# EAGLE design Seymour (EAGLE 9.1.3)

## Sheet 1 of 3
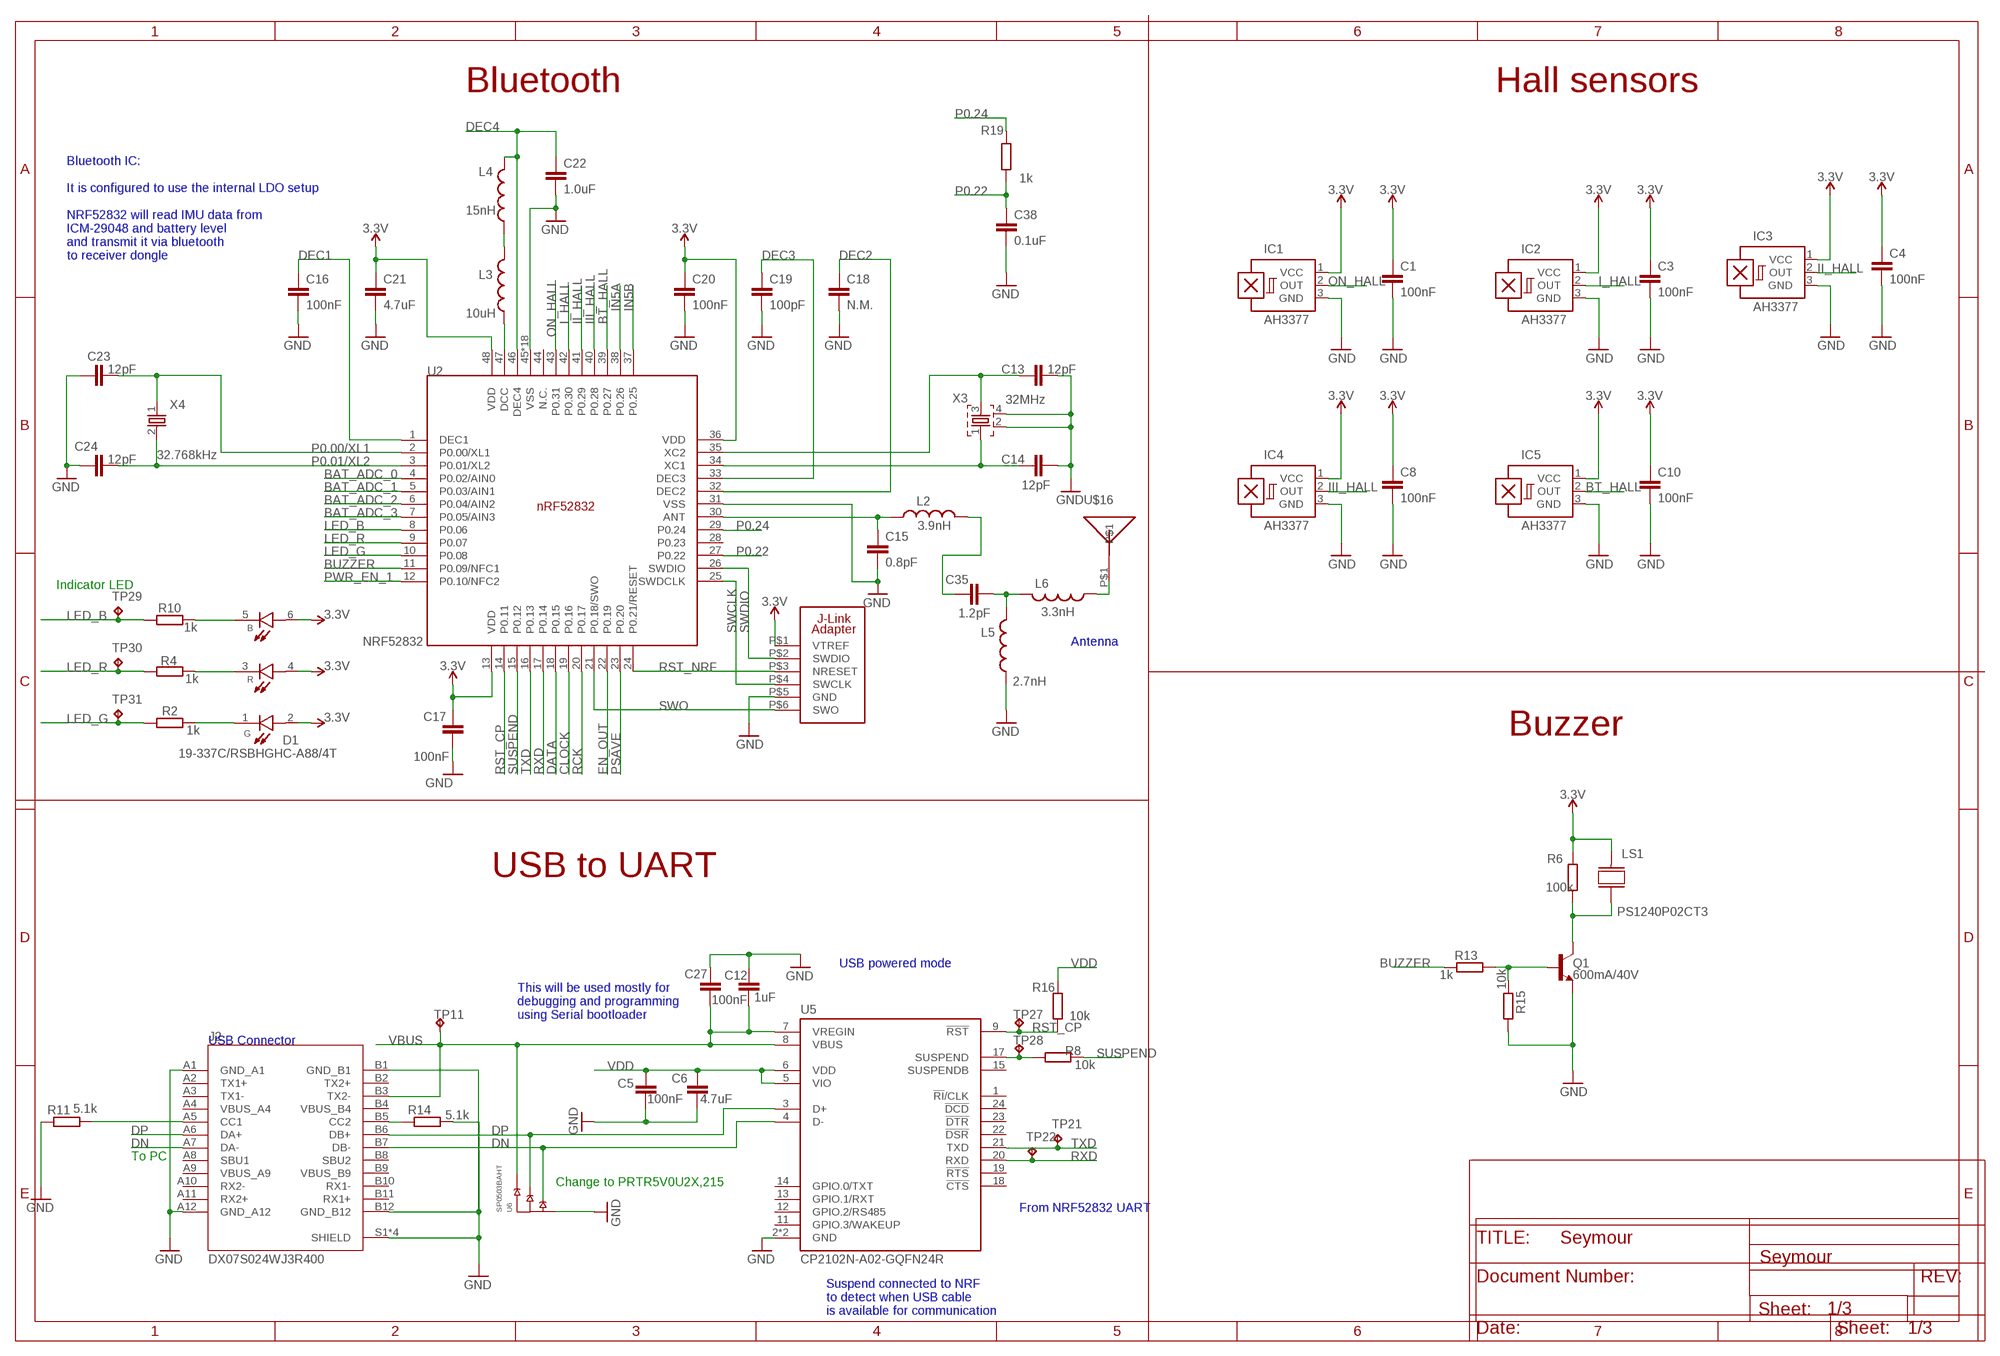
[diagram p0: schematic, sheet 1]

### Parts
C1  100nF  C-EUC0402  [C0402]
C3  100nF  C-EUC0402  [C0402]
C4  100nF  C-EUC0402  [C0402]
C5  100nF  C-EUC0402  [C0402]
C6  4.7uF  C-EUC0603  [C0603]
C8  100nF  C-EUC0402  [C0402]
C10  100nF  C-EUC0402  [C0402]
C12  1uF  C-EUC0603  [C0603]
C13  12pF  C-EUC0402  [C0402]
C14  12pF  C-EUC0402  [C0402]
C15  0.8pF  C-EUC0402  [C0402]
C16  100nF  C-EUC0603  [C0603]
C17  100nF  C-EUC0402  [C0402]
C18  N.M.  C-EUC0603  [C0603]
C19  100pF  C-EUC0402  [C0402]
C20  100nF  C-EUC0402  [C0402]
C21  4.7uF  C-EUC0603  [C0603]
C22  1.0uF  C-EUC0603  [C0603]
C23  12pF  C-EUC0402  [C0402]
C24  12pF  C-EUC0402  [C0402]
C27  100nF  C-EUC0402  [C0402]
C35  1.2pF  CAPACITOR_0402_N  [RESC0402_N]
C38  0.1uF  C-EUC0402  [C0402]
D1  19-337C/RSBHGHC-A88/4T  [LED_19-337C/RSBHGHC-A88/4T]
IC1  AH3377  A1203LH  [SOT23-W]
IC2  AH3377  A1203LH  [SOT23-W]
IC3  AH3377  A1203LH  [SOT23-W]
IC4  AH3377  A1203LH  [SOT23-W]
IC5  AH3377  A1203LH  [SOT23-W]
J2  DX07S024WJ3R400  [JAE_DX07S024WJ3R400]
L2  3.9nH  INDUCTOR_0402_N  [RESC0402_N]
L3  10uH  INDUCTOR_0603_N  [RESC0603_N]
L4  15nH  INDUCTOR_0402_N  [RESC0402_N]
L5  2.7nH  INDUCTOR_0402_N  [RESC0402_N]
L6  3.3nH  INDUCTOR_0402_N  [RESC0402_N]
LS1  PS1240P02CT3  [XDCR_PS1240P02CT3]
Q1  600mA/40V  TRANS_NPN-MMBT2222AL  [SOT23-3]
R2  1k  R-EU_R0402  [R0402]
R4  1k  R-EU_R0402  [R0402]
R6  100k  R-EU_R0402  [R0402]
R8  10k  R-EU_R0402  [R0402]
R10  1k  R-EU_R0402  [R0402]
R11  5.1k  R-EU_R0402  [R0402]
R13  1k  R-EU_R0402  [R0402]
R14  5.1k  R-EU_R0402  [R0402]
R15  10k  R-EU_R0402  [R0402]
R16  10k  R-EU_R0402  [R0402]
R19  1k  R-EU_R0402  [R0402]
TP11  TPTP06R  [TP06R]
TP21  TPTP06R  [TP06R]
TP22  TPTP06R  [TP06R]
TP27  TPTP06R  [TP06R]
TP28  TPTP06R  [TP06R]
TP29  TPTP06R  [TP06R]
TP30  TPTP06R  [TP06R]
TP31  TPTP06R  [TP06R]
U2  NRF52832  [QFN40P600X600X90-48_N]
U5  CP2102N-A02-GQFN24R  [QFN50P400X400X80-25N]
U6  SP0503BAHT  [SOT143]
U$1  J-LINK_6-PIN_ADAPTER-1  [J-LINK_6-PIN_ADAPTER_S]
U$16  ANT_2450AT18B100E  [2450AT18B100E]
X3  32MHz  XTAL_32MHZ  [BT-XTAL_2016_N]
X4  32.768kHz  XTAL_32KHZ  [XTAL_3215_N]

### Nets
3.3V: C1.1 C3.1 C4.1 C8.1 C10.1 C17.1 C20.1 C21.1 D1.2(G_A) D1.4(R_A) D1.6(B_A) IC1.1(VCC) IC2.1(VCC) IC3.1(VCC) IC4.1(VCC) IC5.1(VCC) LS1.2 R6.1 U2.13(VDD) U2.36(VDD) U2.48(VDD) U$1.P$1(VTREF) ; also sheet 2
ANT1: C15.1 L2.1 U2.30(ANT)
BAT_ADC_0: U2.4(P0.02/AIN0) ; also sheet 3
BAT_ADC_1: U2.5(P0.03/AIN1) ; also sheet 3
BAT_ADC_2: U2.6(P0.04/AIN2) ; also sheet 3
BAT_ADC_3: U2.7(P0.05/AIN3) ; also sheet 3
BT_HALL: IC5.2(OUT) U2.39(P0.27)
BUZZER: R13.1 U2.11(P0.09/NFC1)
CLOCK: U2.19(P0.16) ; also sheet 2
DATA: U2.18(P0.15) ; also sheet 2
DEC1: C16.1 U2.1(DEC1)
DEC2: C18.1 U2.32(DEC2)
DEC3: C19.1 U2.33(DEC3)
DEC4: C22.1 L4.2 U2.46(DEC4)
DN: J2.A7(DA-) J2.B7(DB-) U5.4(D-) U6.2(A)
DP: J2.A6(DA+) J2.B6(DB+) U5.3(D+) U6.3(B)
EN_OUT: U2.22(P0.19) ; also sheet 2
GND: C1.2 C3.2 C4.2 C5.1 C6.2 C8.2 C10.2 C12.1 C13.2 C14.2 C15.2 C16.2 C17.2 C18.2 C19.2 C20.2 C21.2 C22.2 C23.1 C24.1 C27.2 C38.2 IC1.3(GND) IC2.3(GND) IC3.3(GND) IC4.3(GND) IC5.3(GND) J2.A1(GND_A1) J2.A12(GND_A12) J2.B1(GND_B1) J2.B12(GND_B12) J2.S1(SHIELD) J2.S2(SHIELD) J2.S3(SHIELD) J2.S4(SHIELD) L5.1 Q1.2(E) R11.1 R14.2 R15.2 U2.31(VSS) U2.45(VSS) U2.PAD(VSS) U2.PAD@VIA01(VSS) U2.PAD@VIA02(VSS) U2.PAD@VIA03(VSS) U2.PAD@VIA04(VSS) U2.PAD@VIA05(VSS) U2.PAD@VIA06(VSS) U2.PAD@VIA07(VSS) U2.PAD@VIA08(VSS) U2.PAD@VIA09(VSS) U2.PAD@VIA10(VSS) U2.PAD@VIA11(VSS) U2.PAD@VIA12(VSS) U2.PAD@VIA13(VSS) U2.PAD@VIA14(VSS) U2.PAD@VIA15(VSS) U2.PAD@VIA16(VSS) U5.2(GND) U5.25(GND) U6.1(GND) U$1.P$5(GND) X3.2 X3.4 ; also sheet 2,3
I_HALL: IC2.2(OUT) U2.42(P0.30)
II_HALL: IC3.2(OUT) U2.41(P0.29)
III_HALL: IC4.2(OUT) U2.40(P0.28)
IN5A: U2.38(P0.26) ; also sheet 2
IN5B: U2.37(P0.25) ; also sheet 2
LED_B: R10.2 TP29.TP U2.8(P0.06)
LED_G: R2.2 TP31.TP U2.10(P0.08)
LED_R: R4.2 TP30.TP U2.9(P0.07) ; also sheet 3
N$1: C13.1 U2.35(XC2) X3.3
N$2: C35.2 L2.2
N$3: R8.1 TP28.TP U5.17(SUSPEND)
N$4: J2.A5(CC1) R11.2
N$5: J2.B5(CC2) R14.1
N$8: D1.3(R_C) R4.1
N$10: D1.5(B_C) R10.1
N$14: Q1.1(B) R13.2 R15.1
N$15: D1.1(G_C) R2.1
N$16: LS1.1 Q1.3(C) R6.2
N$17: L3.1 U2.47(DCC)
N$20: L3.2 L4.1
N$29: C35.1 L5.2 L6.2
N$30: L6.1 U$16.P$1
ON_HALL: IC1.2(OUT) U2.43(P0.31)
P0.00/XL1: C23.2 U2.2(P0.00/XL1) X4.1
P0.01/XL2: C24.2 U2.3(P0.01/XL2) X4.2
P0.22: C38.1 R19.1 U2.27(P0.22)
P0.24: R19.2 U2.29(P0.24)
PSAVE: U2.23(P0.20) ; also sheet 2
PWR_EN_1: U2.12(P0.10/NFC2) ; also sheet 2
RCK: U2.20(P0.17) ; also sheet 2
RST_CP: R16.2 TP27.TP U2.14(P0.11) U5.9(!RST)
RST_NRF: U2.24(P0.21/RESET) U$1.P$3(NRESET)
RXD: TP22.TP U2.17(P0.14) U5.20(RXD)
SUSPEND: R8.2 U2.15(P0.12)
SWCLK: U2.25(SWDCLK) U$1.P$4(SWCLK)
SWDIO: U2.26(SWDIO) U$1.P$2(SWDIO)
SWO: U2.21(P0.18/SWO) U$1.P$6(SWO)
TXD: TP21.TP U2.16(P0.13) U5.21(TXD)
VBUS: C12.2 C27.1 J2.B3(TX2-) TP11.TP U5.7(VREGIN) U5.8(VBUS) U6.4(C) ; also sheet 3
VDD: C5.2 C6.1 R16.1 U5.5(VIO) U5.6(VDD)
X2: C14.1 U2.34(XC1) X3.1
Unconnected: J2.A2(TX1+) J2.A3(TX1-) J2.A4(VBUS_A4) J2.A8(SBU1) J2.A9(VBUS_A9) J2.A10(RX2-) J2.A11(RX2+) J2.B2(TX2+) J2.B4(VBUS_B4) J2.B8(SBU2) J2.B9(VBUS_B9) J2.B10(RX1-) J2.B11(RX1+) U2.28(P0.23) U2.44(N.C.) U5.1(!RI!/CLK) U5.11(GPIO.3/WAKEUP) U5.12(GPIO.2/RS485) U5.13(GPIO.1/RXT) U5.14(GPIO.0/TXT) U5.15(SUSPENDB) U5.18(!CTS) U5.19(!RTS) U5.22(!DSR) U5.23(!DTR) U5.24(!DCD)

### Notes on the sheet
- Bluetooth | Hall sensors
- 1k
- Bluetooth IC:
  
  It is configured to use the internal LDO setup
  
  NRF52832 will read IMU data from 
  ICM-29048 and battery level 
  and transmit it via bluetooth 
  to receiver dongle
- Indicator LED
- Antenna
- Buzzer
- USB to UART
- USB powered mode
- This will be used mostly for 
  debugging and programming 
  using Serial bootloader
- USB Connector
- To PC
- Change to PRTR5V0U2X,215‎
- From NRF52832 UART
- Suspend connected to NRF 
  to detect when USB cable 
  is available for communication

## Sheet 2 of 3
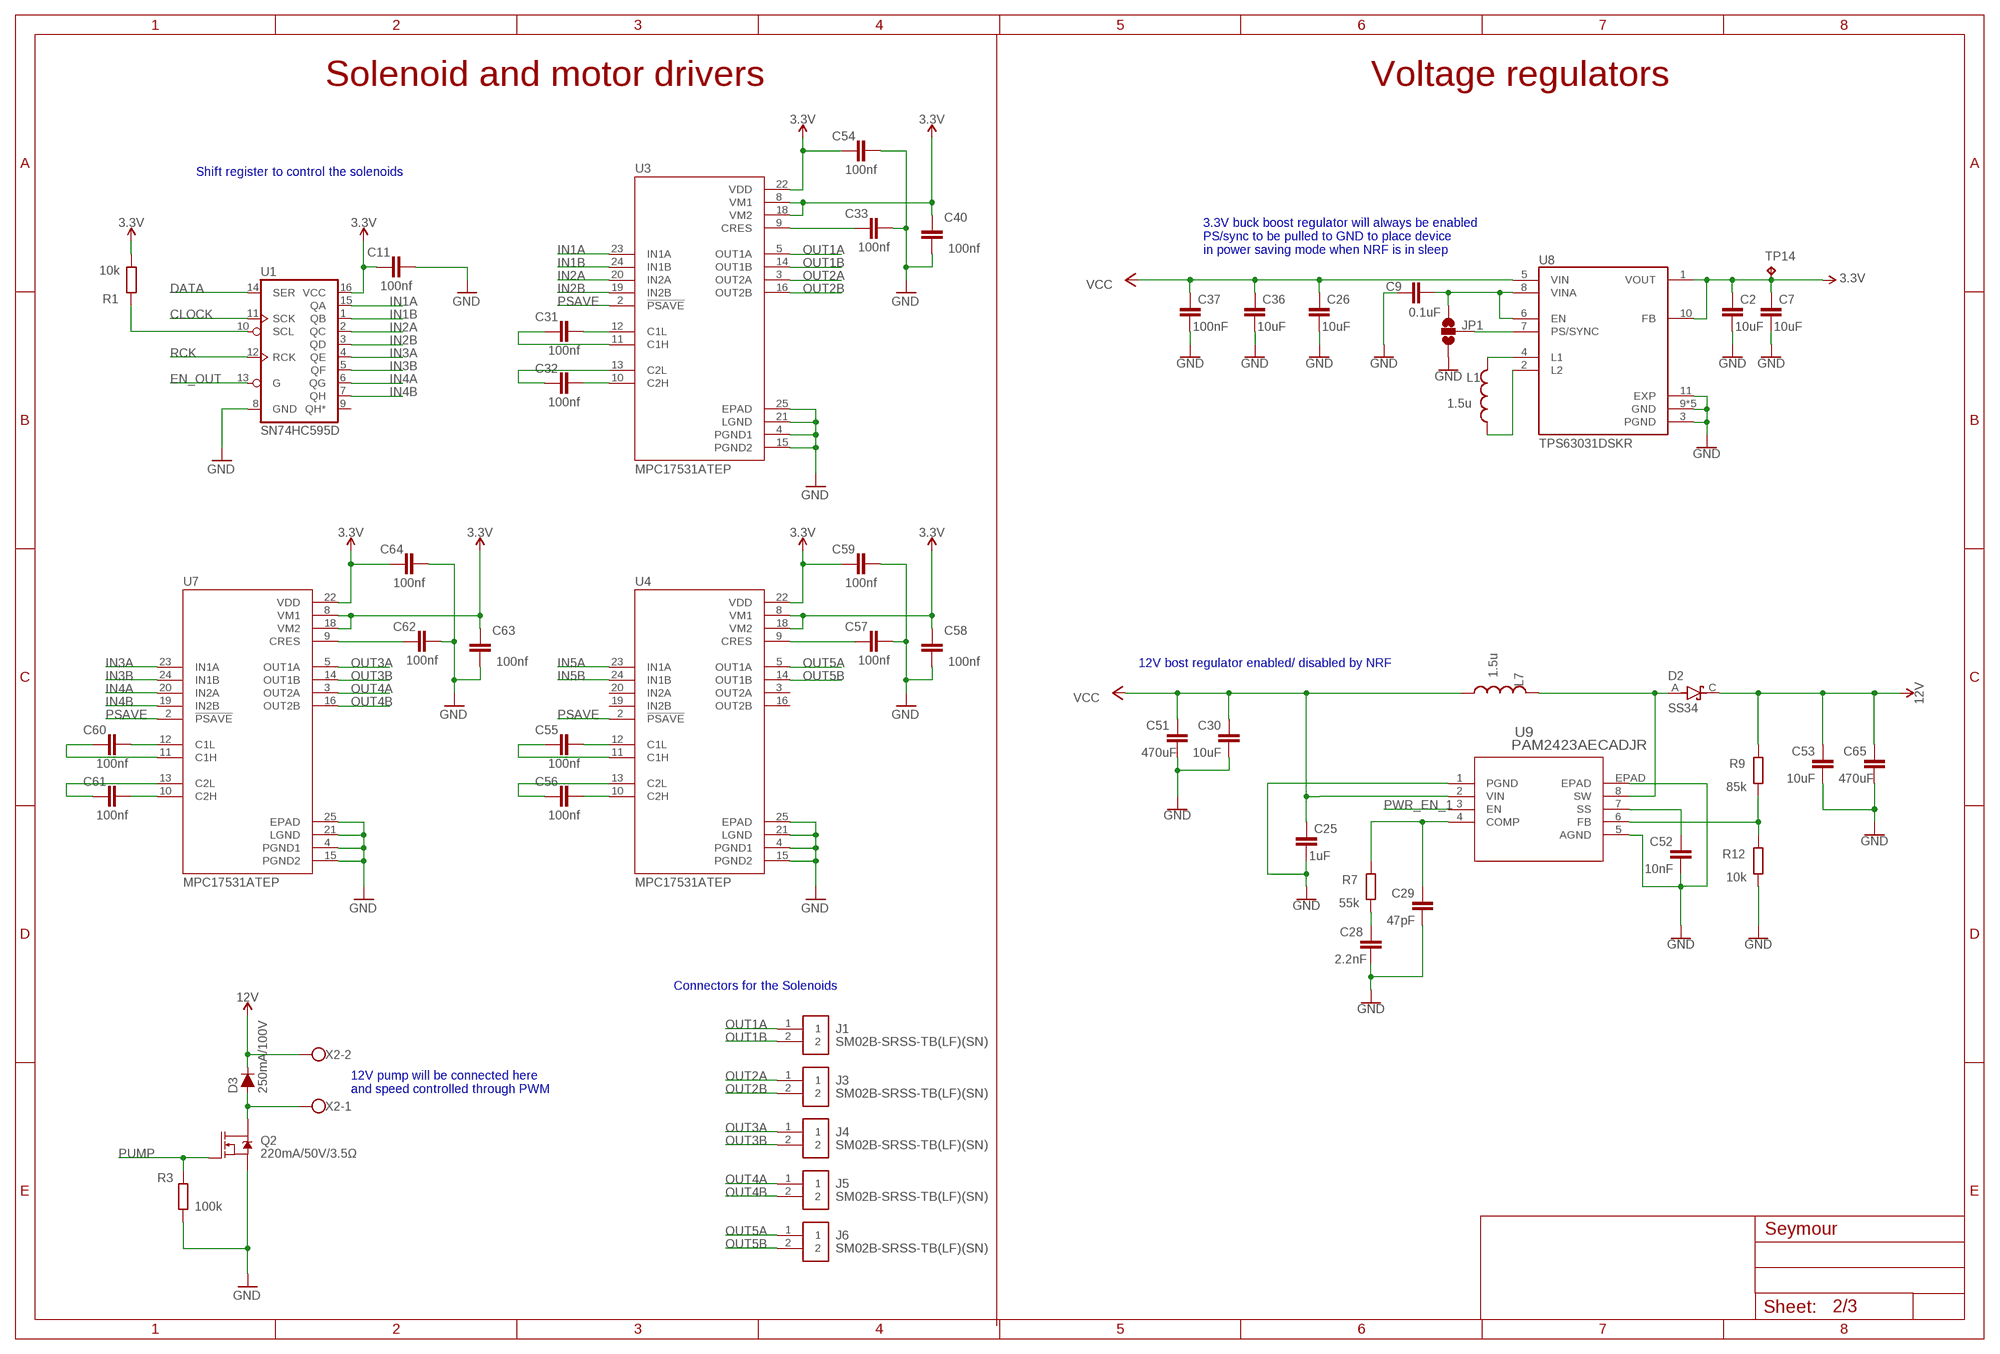
[diagram p1: schematic, sheet 2]

### Parts
C2  10uF  C-EUC0603  [C0603]
C7  10uF  C-EUC0603  [C0603]
C9  0.1uF  C-EUC0603  [C0603]
C11  100nf  CAPACITOR_0402_N  [RESC0402_N]
C25  1uF  C-EUC0603  [C0603]
C26  10uF  C-EUC0603  [C0603]
C28  2.2nF  C-EUC0603  [C0603]
C29  47pF  C-EUC0603  [C0603]
C30  10uF  C-EUC0603  [C0603]
C31  100nf  CAPACITOR_0402_N  [RESC0402_N]
C32  100nf  CAPACITOR_0402_N  [RESC0402_N]
C33  100nf  CAPACITOR_0402_N  [RESC0402_N]
C36  10uF  C-EUC0603  [C0603]
C37  100nF  C-EUC0603  [C0603]
C40  100nf  CAPACITOR_0402_N  [RESC0402_N]
C51  470uF  C-EUC0603  [C0603]
C52  10nF  C-EUC0603  [C0603]
C53  10uF  C-EUC0603  [C0603]
C54  100nf  CAPACITOR_0402_N  [RESC0402_N]
C55  100nf  CAPACITOR_0402_N  [RESC0402_N]
C56  100nf  CAPACITOR_0402_N  [RESC0402_N]
C57  100nf  CAPACITOR_0402_N  [RESC0402_N]
C58  100nf  CAPACITOR_0402_N  [RESC0402_N]
C59  100nf  CAPACITOR_0402_N  [RESC0402_N]
C60  100nf  CAPACITOR_0402_N  [RESC0402_N]
C61  100nf  CAPACITOR_0402_N  [RESC0402_N]
C62  100nf  CAPACITOR_0402_N  [RESC0402_N]
C63  100nf  CAPACITOR_0402_N  [RESC0402_N]
C64  100nf  CAPACITOR_0402_N  [RESC0402_N]
C65  470uF  C-EUC0603  [C0603]
D2  SS34  [DIOM7959X265N]
D3  250mA/100V  DIODE-BAS16J  [SOD-323]
J1  SM02B-SRSS-TB(LF)(SN)  [SM02B-SRSS-TB(LF)(SN)]
J3  SM02B-SRSS-TB(LF)(SN)  [SM02B-SRSS-TB(LF)(SN)]
J4  SM02B-SRSS-TB(LF)(SN)  [SM02B-SRSS-TB(LF)(SN)]
J5  SM02B-SRSS-TB(LF)(SN)  [SM02B-SRSS-TB(LF)(SN)]
J6  SM02B-SRSS-TB(LF)(SN)  [SM02B-SRSS-TB(LF)(SN)]
JP1  SPARKFUN-JUMPERS_JUMPER-SMT_NC  [SPARKFUN-JUMPERS_SMT-JUMPER_TRACE_SILK]
L1  1.5u  XFL4020  [XFL4020]
L7  1.5u  XFL4020  [XFL4020]
Q2  220mA/50V/3.5Ω  MOSFET-NCH-BSS138  [SOT23-3]
R1  10k  R-EU_R0402  [R0402]
R3  100k  R-EU_R0402  [R0402]
R7  55k  R-EU_R0402  [R0402]
R9  85k  R-EU_R0402  [R0402]
R12  10k  R-EU_R0402  [R0402]
TP14  TPTP06R  [TP06R]
U1  SN74HC595D  74HC595D  [SO16]
U3  MPC17531ATEP  [QFN50P400X400X100-25N]
U4  MPC17531ATEP  [QFN50P400X400X100-25N]
U7  MPC17531ATEP  [QFN50P400X400X100-25N]
U8  TPS63031DSKR  [SON50P250X250X80-11N]
U9  PAM2423AECADJR  [SOP-8_PAM2423AECADJR_DIO]
X2  W237-102  [W237-102]

### Nets
3.3V: C2.1 C7.1 C11.2 C40.1 C54.2 C58.1 C59.2 C63.1 C64.2 R1.2 TP14.TP U1.16(VCC) U3.8(VM1) U3.18(VM2) U3.22(VDD) U4.8(VM1) U4.18(VM2) U4.22(VDD) U7.8(VM1) U7.18(VM2) U7.22(VDD) U8.1(VOUT) U8.10(FB) ; also sheet 1
12V: C53.1 C65.1 D2.C(K) D3.C R9.2 X2.2
CLOCK: U1.11(SCK) ; also sheet 1
DATA: U1.14(SER) ; also sheet 1
EN_OUT: U1.13(G) ; also sheet 1
GND: C2.2 C7.2 C9.1 C11.1 C25.2 C26.2 C28.2 C29.2 C30.2 C33.1 C36.2 C37.2 C40.2 C51.2 C52.2 C53.2 C54.1 C57.1 C58.2 C59.1 C62.1 C63.2 C64.1 C65.2 JP1.1 Q2.2(S) R3.2 R12.1 U1.8(GND) U3.4(PGND1) U3.15(PGND2) U3.21(LGND) U3.25(EPAD) U4.4(PGND1) U4.15(PGND2) U4.21(LGND) U4.25(EPAD) U7.4(PGND1) U7.15(PGND2) U7.21(LGND) U7.25(EPAD) U8.3(PGND) U8.9(GND) U8.11(EXP) U8.12(GND) U8.13(GND) U8.14(GND) U8.15(GND) U9.1(PGND) U9.5(AGND) U9.EPAD ; also sheet 1,3
IN1A: U1.15(QA) U3.23(IN1A)
IN1B: U1.1(QB) U3.24(IN1B)
IN2A: U1.2(QC) U3.20(IN2A)
IN2B: U1.3(QD) U3.19(IN2B)
IN3A: U1.4(QE) U7.23(IN1A)
IN3B: U1.5(QF) U7.24(IN1B)
IN4A: U1.6(QG) U7.20(IN2A)
IN4B: U1.7(QH) U7.19(IN2B)
IN5A: U4.23(IN1A) ; also sheet 1
IN5B: U4.24(IN1B) ; also sheet 1
N$6: C9.2 JP1.3 U8.6(EN) U8.8(VINA)
N$7: L1.P$2 U8.4(L1)
N$9: R1.1 U1.10(SCL)
N$11: L1.P$1 U8.2(L2)
N$12: D2.A L7.P$2 U9.8(SW)
N$13: JP1.2 U8.7(PS/SYNC)
N$18: C29.1 R7.2 U9.4(COMP)
N$19: C28.1 R7.1
N$23: C52.1 U9.7(SS)
N$39: R9.1 R12.2 U9.6(FB)
N$43: C32.1 U3.10(C2H)
N$44: C32.2 U3.13(C2L)
N$45: C31.2 U3.11(C1H)
N$46: C31.1 U3.12(C1L)
N$47: C33.2 U3.9(CRES)
N$48: D3.A Q2.3(D) X2.1
N$51: C56.1 U4.10(C2H)
N$52: C56.2 U4.13(C2L)
N$53: C55.2 U4.11(C1H)
N$54: C55.1 U4.12(C1L)
N$55: C57.2 U4.9(CRES)
N$58: C61.1 U7.10(C2H)
N$59: C61.2 U7.13(C2L)
N$60: C60.2 U7.11(C1H)
N$61: C60.1 U7.12(C1L)
N$62: C62.2 U7.9(CRES)
OUT1A: J1.1 U3.5(OUT1A)
OUT1B: J1.2 U3.14(OUT1B)
OUT2A: J3.1 U3.3(OUT2A)
OUT2B: J3.2 U3.16(OUT2B)
OUT3A: J4.1 U7.5(OUT1A)
OUT3B: J4.2 U7.14(OUT1B)
OUT4A: J5.1 U7.3(OUT2A)
OUT4B: J5.2 U7.16(OUT2B)
OUT5A: J6.1 U4.5(OUT1A)
OUT5B: J6.2 U4.14(OUT1B)
PSAVE: U3.2(!PSAVE) U4.2(!PSAVE) U7.2(!PSAVE) ; also sheet 1
PUMP: Q2.1(G) R3.1
PWR_EN_1: U9.3(EN) ; also sheet 1
RCK: U1.12(RCK) ; also sheet 1
VCC: C25.1 C26.1 C30.1 C36.1 C37.1 C51.1 L7.P$1 U8.5(VIN) U9.2(VIN) ; also sheet 3
Unconnected: U1.9(QH*) U4.3(OUT2A) U4.16(OUT2B) U4.19(IN2B) U4.20(IN2A)

### Notes on the sheet
- Solenoid and motor drivers | Voltage regulators
- Shift register to control the solenoids
- 3.3V buck boost regulator will always be enabled
  PS/sync to be pulled to GND to place device 
  in power saving mode when NRF is in sleep
- 12V bost regulator enabled/ disabled by NRF
- Connectors for the Solenoids
- 12V pump will be connected here 
  and speed controlled through PWM

## Sheet 3 of 3
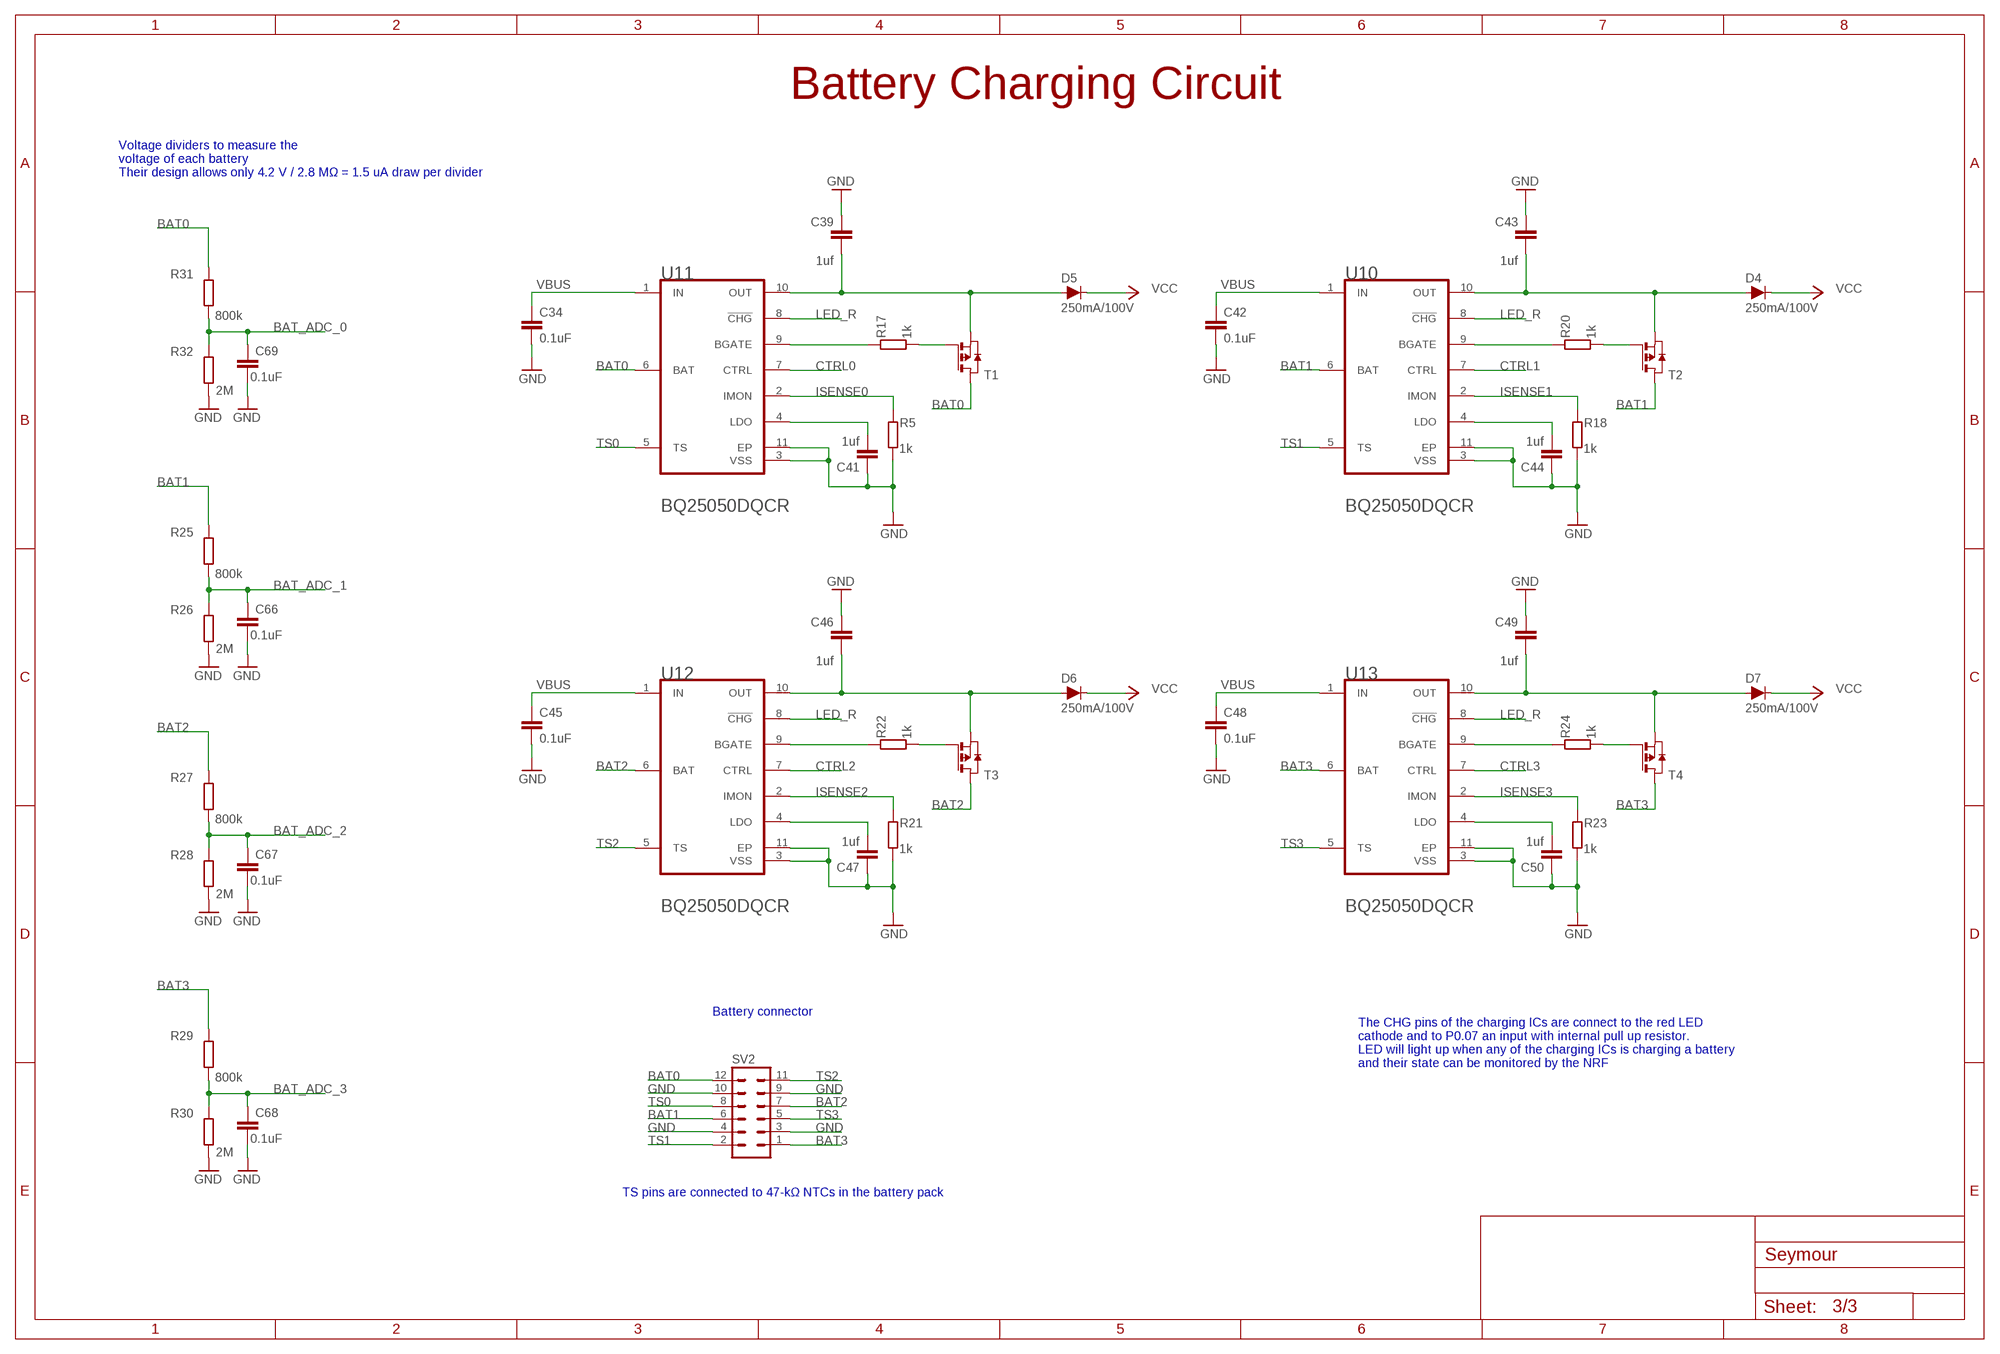
[diagram p2: schematic, sheet 3]

### Parts
C34  0.1uF  C-EUC0402  [C0402]
C39  1uf  C-EUC0402  [C0402]
C41  1uf  C-EUC0402  [C0402]
C42  0.1uF  C-EUC0402  [C0402]
C43  1uf  C-EUC0402  [C0402]
C44  1uf  C-EUC0402  [C0402]
C45  0.1uF  C-EUC0402  [C0402]
C46  1uf  C-EUC0402  [C0402]
C47  1uf  C-EUC0402  [C0402]
C48  0.1uF  C-EUC0402  [C0402]
C49  1uf  C-EUC0402  [C0402]
C50  1uf  C-EUC0402  [C0402]
C66  0.1uF  C-EUC0402  [C0402]
C67  0.1uF  C-EUC0402  [C0402]
C68  0.1uF  C-EUC0402  [C0402]
C69  0.1uF  C-EUC0402  [C0402]
D4  250mA/100V  DIODE-BAS16J  [SOD-323]
D5  250mA/100V  DIODE-BAS16J  [SOD-323]
D6  250mA/100V  DIODE-BAS16J  [SOD-323]
D7  250mA/100V  DIODE-BAS16J  [SOD-323]
R5  1k  R-EU_R0402  [R0402]
R17  1k  R-EU_R0402  [R0402]
R18  1k  R-EU_R0402  [R0402]
R20  1k  R-EU_R0402  [R0402]
R21  1k  R-EU_R0402  [R0402]
R22  1k  R-EU_R0402  [R0402]
R23  1k  R-EU_R0402  [R0402]
R24  1k  R-EU_R0402  [R0402]
R25  800k  R-EU_R0402  [R0402]
R26  2M  R-EU_R0402  [R0402]
R27  800k  R-EU_R0402  [R0402]
R28  2M  R-EU_R0402  [R0402]
R29  800k  R-EU_R0402  [R0402]
R30  2M  R-EU_R0402  [R0402]
R31  800k  R-EU_R0402  [R0402]
R32  2M  R-EU_R0402  [R0402]
SV2  MA06-2  [MA06-2]
T1  PMOSSOT23  [SOT-23]
T2  PMOSSOT23  [SOT-23]
T3  PMOSSOT23  [SOT-23]
T4  PMOSSOT23  [SOT-23]
U10  TEXAS_INSTRUMENTS_BQ25050DQCRTEXAS_INSTRUMENTS_BQ25050DQCR_0_0  [TEXAS_INSTRUMENTS_BQ25050DQCR_0]
U11  TEXAS_INSTRUMENTS_BQ25050DQCRTEXAS_INSTRUMENTS_BQ25050DQCR_0_0  [TEXAS_INSTRUMENTS_BQ25050DQCR_0]
U12  TEXAS_INSTRUMENTS_BQ25050DQCRTEXAS_INSTRUMENTS_BQ25050DQCR_0_0  [TEXAS_INSTRUMENTS_BQ25050DQCR_0]
U13  TEXAS_INSTRUMENTS_BQ25050DQCRTEXAS_INSTRUMENTS_BQ25050DQCR_0_0  [TEXAS_INSTRUMENTS_BQ25050DQCR_0]

### Nets
BAT0: R31.2 SV2.12 T1.1(D) U11.6(BAT)
BAT1: R25.2 SV2.6 T2.1(D) U10.6(BAT)
BAT2: R27.2 SV2.7 T3.1(D) U12.6(BAT)
BAT3: R29.2 SV2.1 T4.1(D) U13.6(BAT)
BAT_ADC_0: C69.1 R31.1 R32.2 ; also sheet 1
BAT_ADC_1: C66.1 R25.1 R26.2 ; also sheet 1
BAT_ADC_2: C67.1 R27.1 R28.2 ; also sheet 1
BAT_ADC_3: C68.1 R29.1 R30.2 ; also sheet 1
CTRL0: U11.7(CTRL)
CTRL1: U10.7(CTRL)
CTRL2: U12.7(CTRL)
CTRL3: U13.7(CTRL)
GND: C34.2 C39.1 C41.1 C42.2 C43.1 C44.1 C45.2 C46.1 C47.1 C48.2 C49.1 C50.1 C66.2 C67.2 C68.2 C69.2 R5.1 R18.1 R21.1 R23.1 R26.1 R28.1 R30.1 R32.1 SV2.3 SV2.4 SV2.9 SV2.10 U10.3(VSS) U10.11(EP) U11.3(VSS) U11.11(EP) U12.3(VSS) U12.11(EP) U13.3(VSS) U13.11(EP) ; also sheet 1,2
ISENSE0: R5.2 U11.2(IMON)
ISENSE1: R18.2 U10.2(IMON)
ISENSE2: R21.2 U12.2(IMON)
ISENSE3: R23.2 U13.2(IMON)
LED_R: U10.8(!CHG!) U11.8(!CHG!) U12.8(!CHG!) U13.8(!CHG!) ; also sheet 1
N$21: R17.1 T1.3(G)
N$24: R17.2 U11.9(BGATE)
N$26: C39.2 D5.A T1.2(S) U11.10(OUT)
N$27: C44.2 U10.4(LDO)
N$28: C41.2 U11.4(LDO)
N$31: C43.2 D4.A T2.2(S) U10.10(OUT)
N$33: R20.2 U10.9(BGATE)
N$34: R20.1 T2.3(G)
N$36: C47.2 U12.4(LDO)
N$37: C46.2 D6.A T3.2(S) U12.10(OUT)
N$40: R22.2 U12.9(BGATE)
N$41: R22.1 T3.3(G)
N$50: C50.2 U13.4(LDO)
N$56: C49.2 D7.A T4.2(S) U13.10(OUT)
N$63: R24.2 U13.9(BGATE)
N$64: R24.1 T4.3(G)
TS0: SV2.8 U11.5(TS)
TS1: SV2.2 U10.5(TS)
TS2: SV2.11 U12.5(TS)
TS3: SV2.5 U13.5(TS)
VBUS: C34.1 C42.1 C45.1 C48.1 U10.1(IN) U11.1(IN) U12.1(IN) U13.1(IN) ; also sheet 1
VCC: D4.C D5.C D6.C D7.C ; also sheet 2

### Notes on the sheet
- Battery Charging Circuit
- Voltage dividers to measure the
  voltage of each battery
  Their design allows only 4.2 V / 2.8 MΩ = 1.5 uA draw per divider
- Battery connector
- The CHG pins of the charging ICs are connect to the red LED
  cathode and to P0.07 an input with internal pull up resistor.
  LED will light up when any of the charging ICs is charging a battery
  and their state can be monitored by the NRF
- TS pins are connected to 47-kΩ NTCs in the battery pack

## Library data of the parts
C1 C3 C4 C8 C10 C17 C20 C34 C39 C41-C50 C66-C69 = rcl:C-EU: CAPACITOR, European symbol; SPICEPREFIX: C
C2 C5-C7 C9 C12-C16 C18 C19 C21-C30 C36-C38 C51-C53 C65 = resistor:C-EU: CAPACITOR, European symbol
C11 C31-C33 C35 C40 C54-C64 = Nordic_nRF:CAPACITOR: Generic chip capacitor
D1 = led:19-337C/RSBHGHC-A88/4T: Red, Green, Blue (RGB) 625nm Red, 530nm Green, 470nm Blue LED Indication - Discrete 2.05V Red, 2.9V Green, 2.9V Blue 0606 (1616 Metric) Check prices <https://pricing.snapeda.com/parts/19-337C/RSBHGHC-A88/4T/Everlight%20Electronics%20Co%20Ltd/view-part?ref=eda>; AVAILABILITY: Warning; DESCRIPTION: Red, Green, Blue (RGB) 625nm Red, 530nm Green, 470nm Blue LED Indication - Discrete 2.05V Red, 2.9V Green, 2.9V Blue 0606 (1616 Metric); MF: Everlight Electronics Co Ltd; MP: 19-337C/RSBHGHC-A88/4T; PACKAGE: 0606 Everlight Electronics Co Ltd; PRICE: None; PURCHASE-URL: https://pricing.snapeda.com/search/part/19-337C/RSBHGHC-A88/4T/?ref=eda
D2 = SS34:SS34: Diode Schottky 40V 3A 2-Pin SMC T/R Check prices <https://pricing.snapeda.com/parts/SS34/ON%20Semiconductor/view-part?ref=eda>; AVAILABILITY: In Stock; DESCRIPTION: Diode Schottky 40V 3A Surface Mount SMC (DO-214AB); MF: ON Semiconductor; MP: SS34; PACKAGE: SMC-2 ON Semiconductor; PRICE: None; PURCHASE-URL: https://pricing.snapeda.com/search/part/SS34/?ref=eda
D3-D7 = SparkFun-DiscreteSemi:DIODE: Diode These are standard reverse protection diodes and small signal diodes. SparkFun Products: SparkFun SparkPunk Sound Kit <https://www.sparkfun.com/products/11177> SparkFun ESP8266 Thing <https://www.sparkfun.com/products/13231>; PROD_ID: DIO-09646
IC1-IC5 = allegro:A12*?: Hall-effect bipolar switch Source: http://www.allegromicro.com/en/Products/Part_Numbers/1202/1202.pdf; MF: ALLEGRO MICROSYSTEMS, INC.; MPN: A1203LLHLT-T; OC_FARNELL: 1791384; OC_NEWARK: 31K6608
J1 J3-J6 = SM02B-SRSS-TB_LF__SN_:SM02B-SRSS-TB(LF)(SN): JST (JAPAN SOLDERLESS TERMINALS) - SM02B-SRSS-TB (LF)(SN) - HEADER, R/A, 2WAY Source: Datasheet <http://www.jst-mfg.com/product/pdf/eng/eSH.pdf>; AVAILABILITY: Unavailable; DESCRIPTION: Connector Header Surface Mount, Right Angle 2 position 0.039 _1.00mm_; MF: JST Sales; MP: SM02B-SRSS-TB_LF__SN_; PACKAGE: None; PRICE: None
J2 = DX07S024WJ3R400:DX07S024WJ3R400: Conn Rcpt Usb3.1 Typec Smd Vert; DESCRIPTION: USB-C (USB TYPE-C) USB 3.2 Gen 2 (USB 3.1 Gen 2, Superspeed + (USB 3.1)) Receptacle Connector 24 Position Surface Mount, Through Hole; DIGI-KEY_PART_NUMBER: 670-2950-1-ND; MF: JAE Electronics; MP: DX07S024WJ3R400; PACKAGE: None; PURCHASE-URL: https://pricing.snapeda.com/search/part/DX07S024WJ3R400/?ref=eda
JP1 = DECAMove:SPARKFUN-JUMPERS_JUMPER-SMT: Normally closed trace jumper (1 of 2 connections) This jumper has a trace between two pads so it's normally closed (NC). The other connection is normally open (NO). Use a razor knife to open the connection. For best results follow the IPC guidelines for cutting traces: Cutout at least 0.063 mm (0.005 in). Remove all loose material to clean up the cut area. Seal the cut with an approved epoxy. Reapply solder to reclose the connection, or to close the NO connection.
L1 L7 = inductor-coilcraft:XFL4020: Coilcraft shielded 4x4mm high temperature inductor
L2-L6 = Nordic_nRF:INDUCTOR: Generic chip inductor
LS1 = PS1240P02CT3:PS1240P02CT3: Buzzers Transducer, Externally Driven Piezo 3V 4kHz 60dB @ 3V, 10cm Through Hole PC Pins; DESCRIPTION: Buzzers Transducer, Externally Driven Piezo 3V 4kHz 60dB @ 3V, 10cm Through Hole PC Pins; DIGI-KEY_PART_NUMBER: 445-5229-1-ND; MF: TDK; MP: PS1240P02CT3; PACKAGE: SIP-5 TDK; PURCHASE-URL: https://pricing.snapeda.com/search/part/PS1240P02CT3/?ref=eda
Q1 = SparkFun-DiscreteSemi:TRANS_NPN: NPN transistor Current controlled devices typically used to amplify current or used as a switch. BC547 - COM-08928 <http://www.sparkfun.com/products/8928> (TO-92 45V 100mA) (1.Collector 2.Base 3.Emitter) 2N3904 - COM-00521 <http://www.sparkfun.com/products/521> (TO-92 40V 200mA) (1.Emitter 2.Base 3.Collector) P2N2222A - COM-12852 <http://www.sparkfun.com/products/12852> (TO-92 40V 600mA) (1.Collector 2.Base 3.Emitter); PROD_ID: TRANS-08049
Q2 = SparkFun-DiscreteSemi:MOSFET-NCH: N-channel MOSFETs Voltage controlled devices that allow control of high current outputs. SparkFun Products: SparkFun OpenScale <https://www.sparkfun.com/products/13261> SparkFun Digital Sandbox <https://www.sparkfun.com/products/12651> SparkFun Monster Moto Shield <https://www.sparkfun.com/products/10182> SparkFun MOSFET Power Controller <https://www.sparkfun.com/products/11214>; PROD_ID: TRANS-00830
R1-R4 R6-R10 R12 R13 R15 R16 R25-R32 = resistor:R-EU_: RESISTOR, European symbol
R5 R11 R14 R17-R24 = rcl:R-EU_: RESISTOR, European symbol; SPICEPREFIX: R
SV2 = con-lstb:MA06-2: PIN HEADER; OC_FARNELL: unknown; OC_NEWARK: unknown
T1-T4 = zetex:PMOSSOT23: MOS FET; OC_FARNELL: unknown; OC_NEWARK: unknown
TP11 TP14 TP21 TP22 TP27-TP31 = testpad:TP: Test pad
U1 = SparkFun-IC-Logic:74*595: 8-Bit Shift Register (Serial to Parallel) Datasheet <http://cdn.sparkfun.com/datasheets/BreakoutBoards/MM74HC595.pdf> SparkFun Products SparkFun Shift Register Breakout - 74HC595 <https://www.sparkfun.com/products/10680> (BOB-10680); PROD_ID: IC-07875
U2 = Nordic_nRF:NRF52832: nRF52832 Features Single chip, highly flexible, 2.4 GHz multi-protocol SoC 32-bit ARM Cortex-M4F Processor 1.7v to 3.6v operation 512kB flash + 64kB RAM Supports concurrent Bluetooth Smart/ANT protocol operation On-chip NFC tag for Out-of-Band (OOB) pairing Up to +4dBm output power -96dBm sensitivity, Bluetooth Smart Thread safe and run-time protected Event driven API On air compatible with nRF24L and nRF24AP series 2 data rates (2Mbps/1Mbps) PPI - maximum flexibility for power-efficient applications and code simplification Automated power management system with automatic power management of each peripheral Configurable I/O mapping for analog and digital I/O 3 x Master/Slave SPI 2 x Two-wire interface (I²C) UART (RTS/CTS) 3 x PWM AES HW encryption Real Time Counter (RTC) Digital microphone interface (PDM) On-chip balun Applications Internet of Things (IoT) Wearables SmartHome sensors Connected white goods Computer peripherals Voice-command smart remotes A4WP ‘Rezence’ wireless charging Beacons Sports and fitness sensors and hubs Connected health products Smart watches RC Toys Interactive games Building automation and sensor networks
U3 U4 U7 = MPC17531ATEP:MPC17531ATEP: H-Bridge, Dual, Low Voltage, Stepper & DC Brushed Motor Driver, 2-8.6V, 1.4A, 200kHz, QFN 24, Tray Check prices <https://pricing.snapeda.com/parts/MPC17531ATEP/NXP%20Semiconductors/view-part?ref=eda>; AVAILABILITY: In Stock; DESCRIPTION: Dual H-Bridge Motor Driver 3V 24-Pin QFN EP Tray; MF: NXP Semiconductors; MP: MPC17531ATEP; PACKAGE: None; PRICE: None; PURCHASE-URL: https://pricing.snapeda.com/search/part/MPC17531ATEP/?ref=eda
U5 = silabs:CP2102N-A02-GQFN24R: Check prices <https://pricing.snapeda.com/parts/CP2102N-A02-GQFN24R/Silicon%20Labs/view-part?ref=eda>; AVAILABILITY: Warning; DESCRIPTION: USB Bridge, USB to UART USB 2.0 UART Interface 24-QFN (4x4); MF: Silicon Labs; MP: CP2102N-A02-GQFN24R; PACKAGE: WFQFN-24 Silicon Labs; PRICE: None; PURCHASE-URL: https://pricing.snapeda.com/search/part/CP2102N-A02-GQFN24R/?ref=eda
U6 = diode:SP0503BAHT; AVAILABILITY: Unavailable; DESCRIPTION: 8.5V Clamp Ipp Tvs Diode Surface Mount SOT-143-4; MF: Littelfuse Inc.; MP: SP0503BAHT; PACKAGE: SOT-143 Littelfuse; PRICE: None
U8 = TPS63031DSKR:TPS63031DSKR: High Efficient Single Inductor Buck-Boost Converter with 1-A Switches Check prices <https://pricing.snapeda.com/parts/TPS63031DSKR/Texas%20Instruments/view-part?ref=eda>; AVAILABILITY: Good; DESCRIPTION: High Efficient Single Inductor Buck-Boost Converter with 1-A Switches 10-SON -40 to 85; MF: Texas Instruments; MP: TPS63031DSKR; PACKAGE: WSON-10 Texas Instruments; PRICE: None; PURCHASE-URL: https://pricing.snapeda.com/search/part/TPS63031DSKR/?ref=eda
U9 = PAM2423AECADJR:PAM2423AECADJR; COPYRIGHT: Copyright (C) 2021 Ultra Librarian. All rights reserved.; DIGI-KEY_PART_NUMBER_1: PAM2423AECADJRDITR-ND; DIGI-KEY_PART_NUMBER_2: PAM2423AECADJRDICT-ND; DIGI-KEY_PART_NUMBER_3: PAM2423AECADJRDIDKR-ND; MANUFACTURER_PART_NUMBER: PAM2423AECADJR; MFR_NAME: Diodes Inc
U10-U13 = Texas Instruments - BQ25050DQCR:TEXAS_INSTRUMENTS_BQ25050DQCR: TI-BQ25050DQC10-2400X840TP; DATASHEET: http://www.ti.com/general/docs/lit/getliterature.tsp?genericPartNumber=BQ25050&fileType=pdf; DATASHEET_VERSION: SLUSA33; IMPORTED: yes; IMPORTED_FROM: vault; IMPORT_TS: 1521149580; LEAD_ACID: N; LI__ION: N; LI__POLYMER: N; MF: Texas Instruments; MOUNTING_TECHNOLOGY: Surface Mount; MPN: BQ25050DQCR; NI_CD: N; NI_MH: N; OVER_VOLTAGE_PROTECTION: N; PACKAGE: DQC0010A; PACKAGE_DESCRIPTION: 10-Pin Plastic Small Outline No-Lead, 2 x 3 x 0.8 mm Body, 0.5 mm Pitch, Exposed Pad; PACKAGE_VERSION: revA, Jul-2008; PREFIX: U; ROHS: Yes; SUB_FAMILY: Battery Charge Management; VAULT_GUID: 3EB91702-DF68-4836-8F8E-4B956DA718DA; VAULT_REVISION: C57A6326-882D-4660-8B69-1983E239C76B
U$1 = debug-connectors:J-LINK_6-PIN_ADAPTER: J-Link 6-pin Adapter See https://www.segger.com/jlink-6-pin-adapter.html
U$16 = Johanson_antennas:ANT_2450AT18B100E
X2 = con-wago-500:W237-102: WAGO SCREW CLAMP; MPN: 237-102; OC_FARNELL: unknown; OC_NEWARK: 70K9898
X3 = Nordic_nRF:XTAL_32MHZ
X4 = Nordic_nRF:XTAL_32KHZ

## Net classes
2 lowpower: width 0.254 mm, drill 0.381 mm

## Board
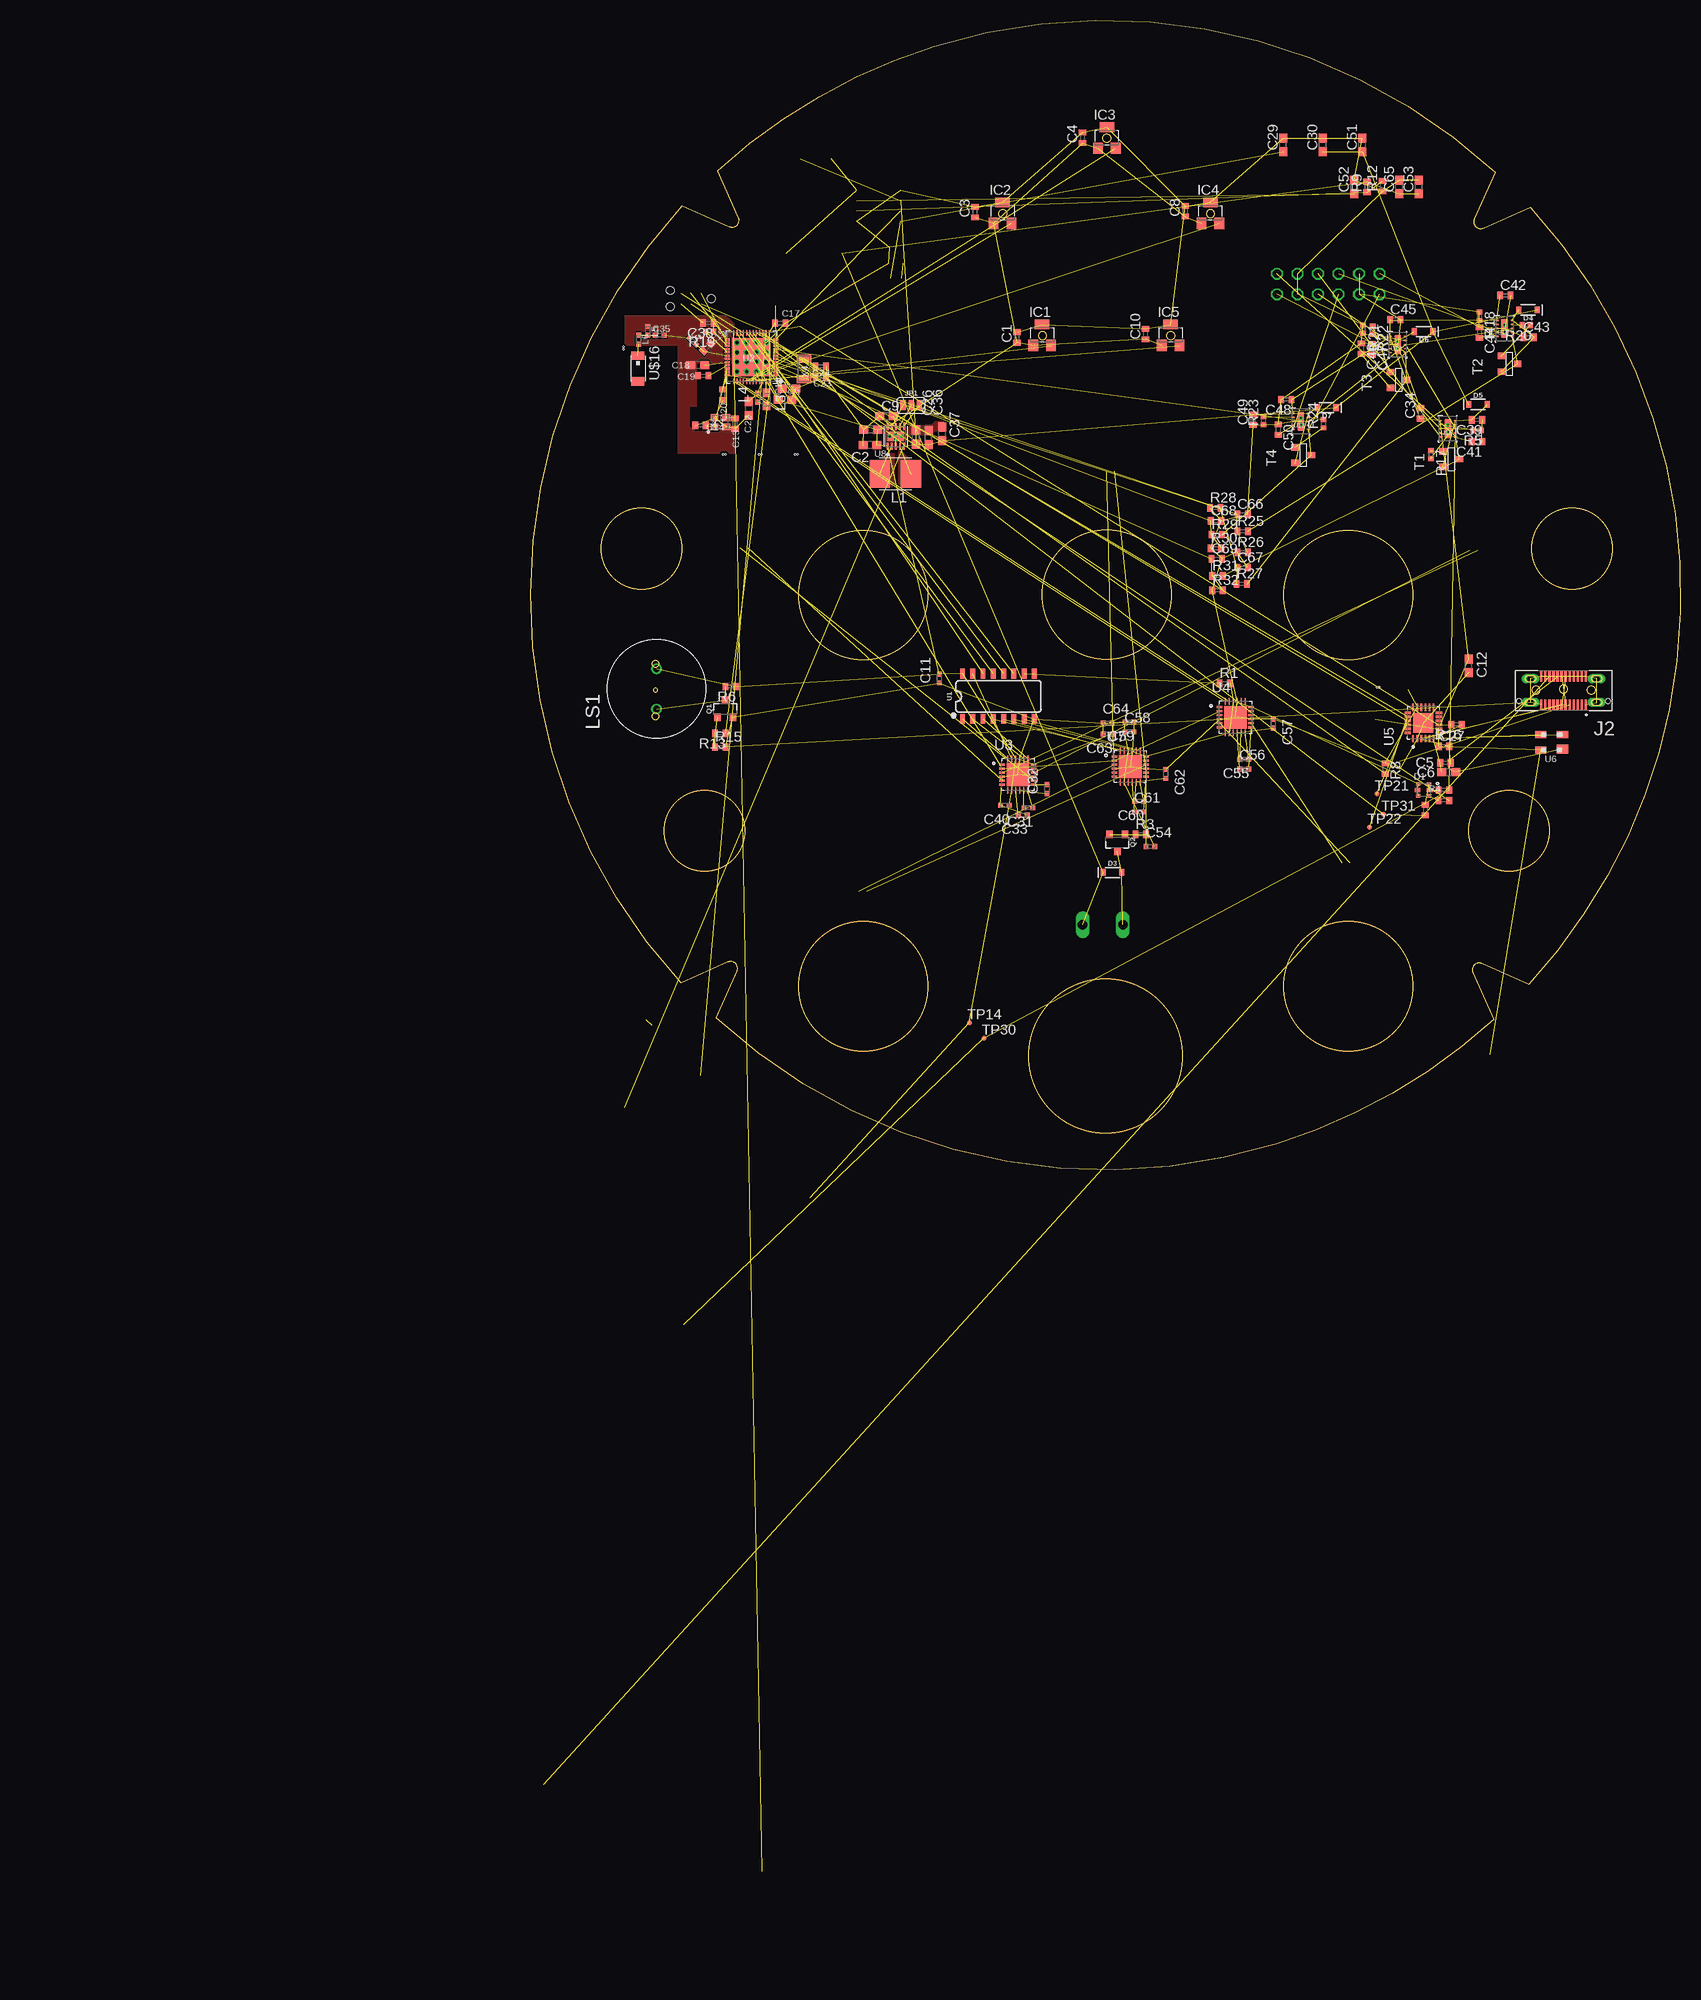
[diagram p3: board, top side]
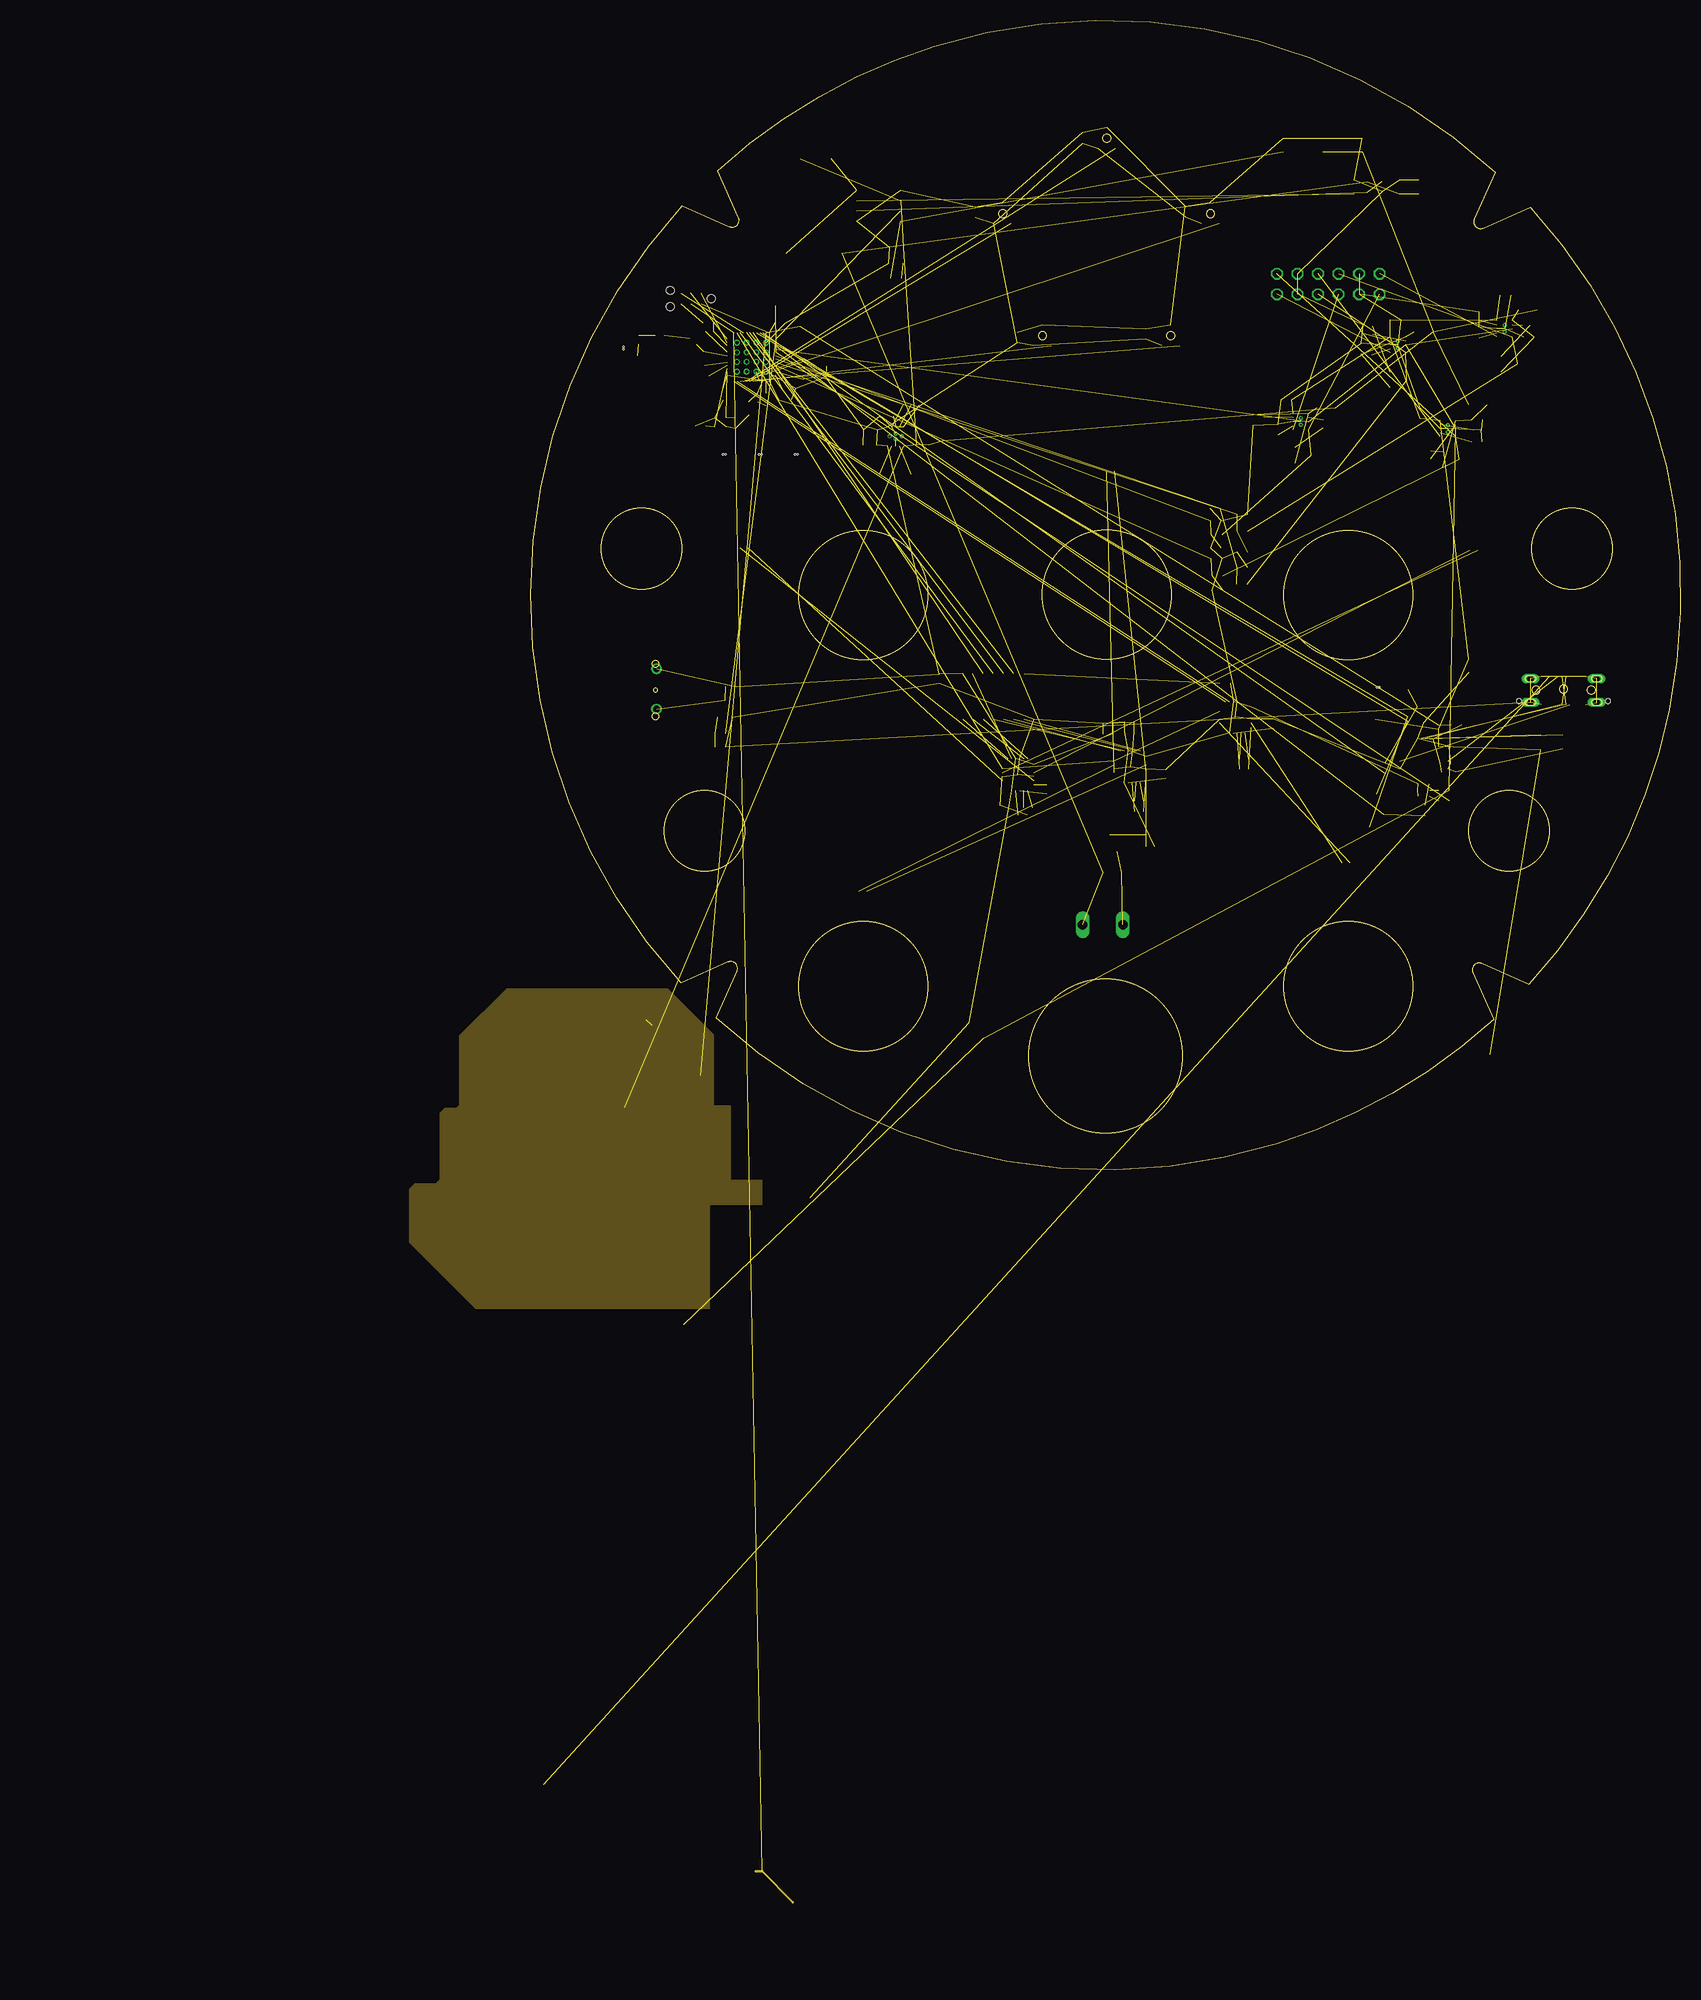
[diagram p4: board, inner layer Route2]
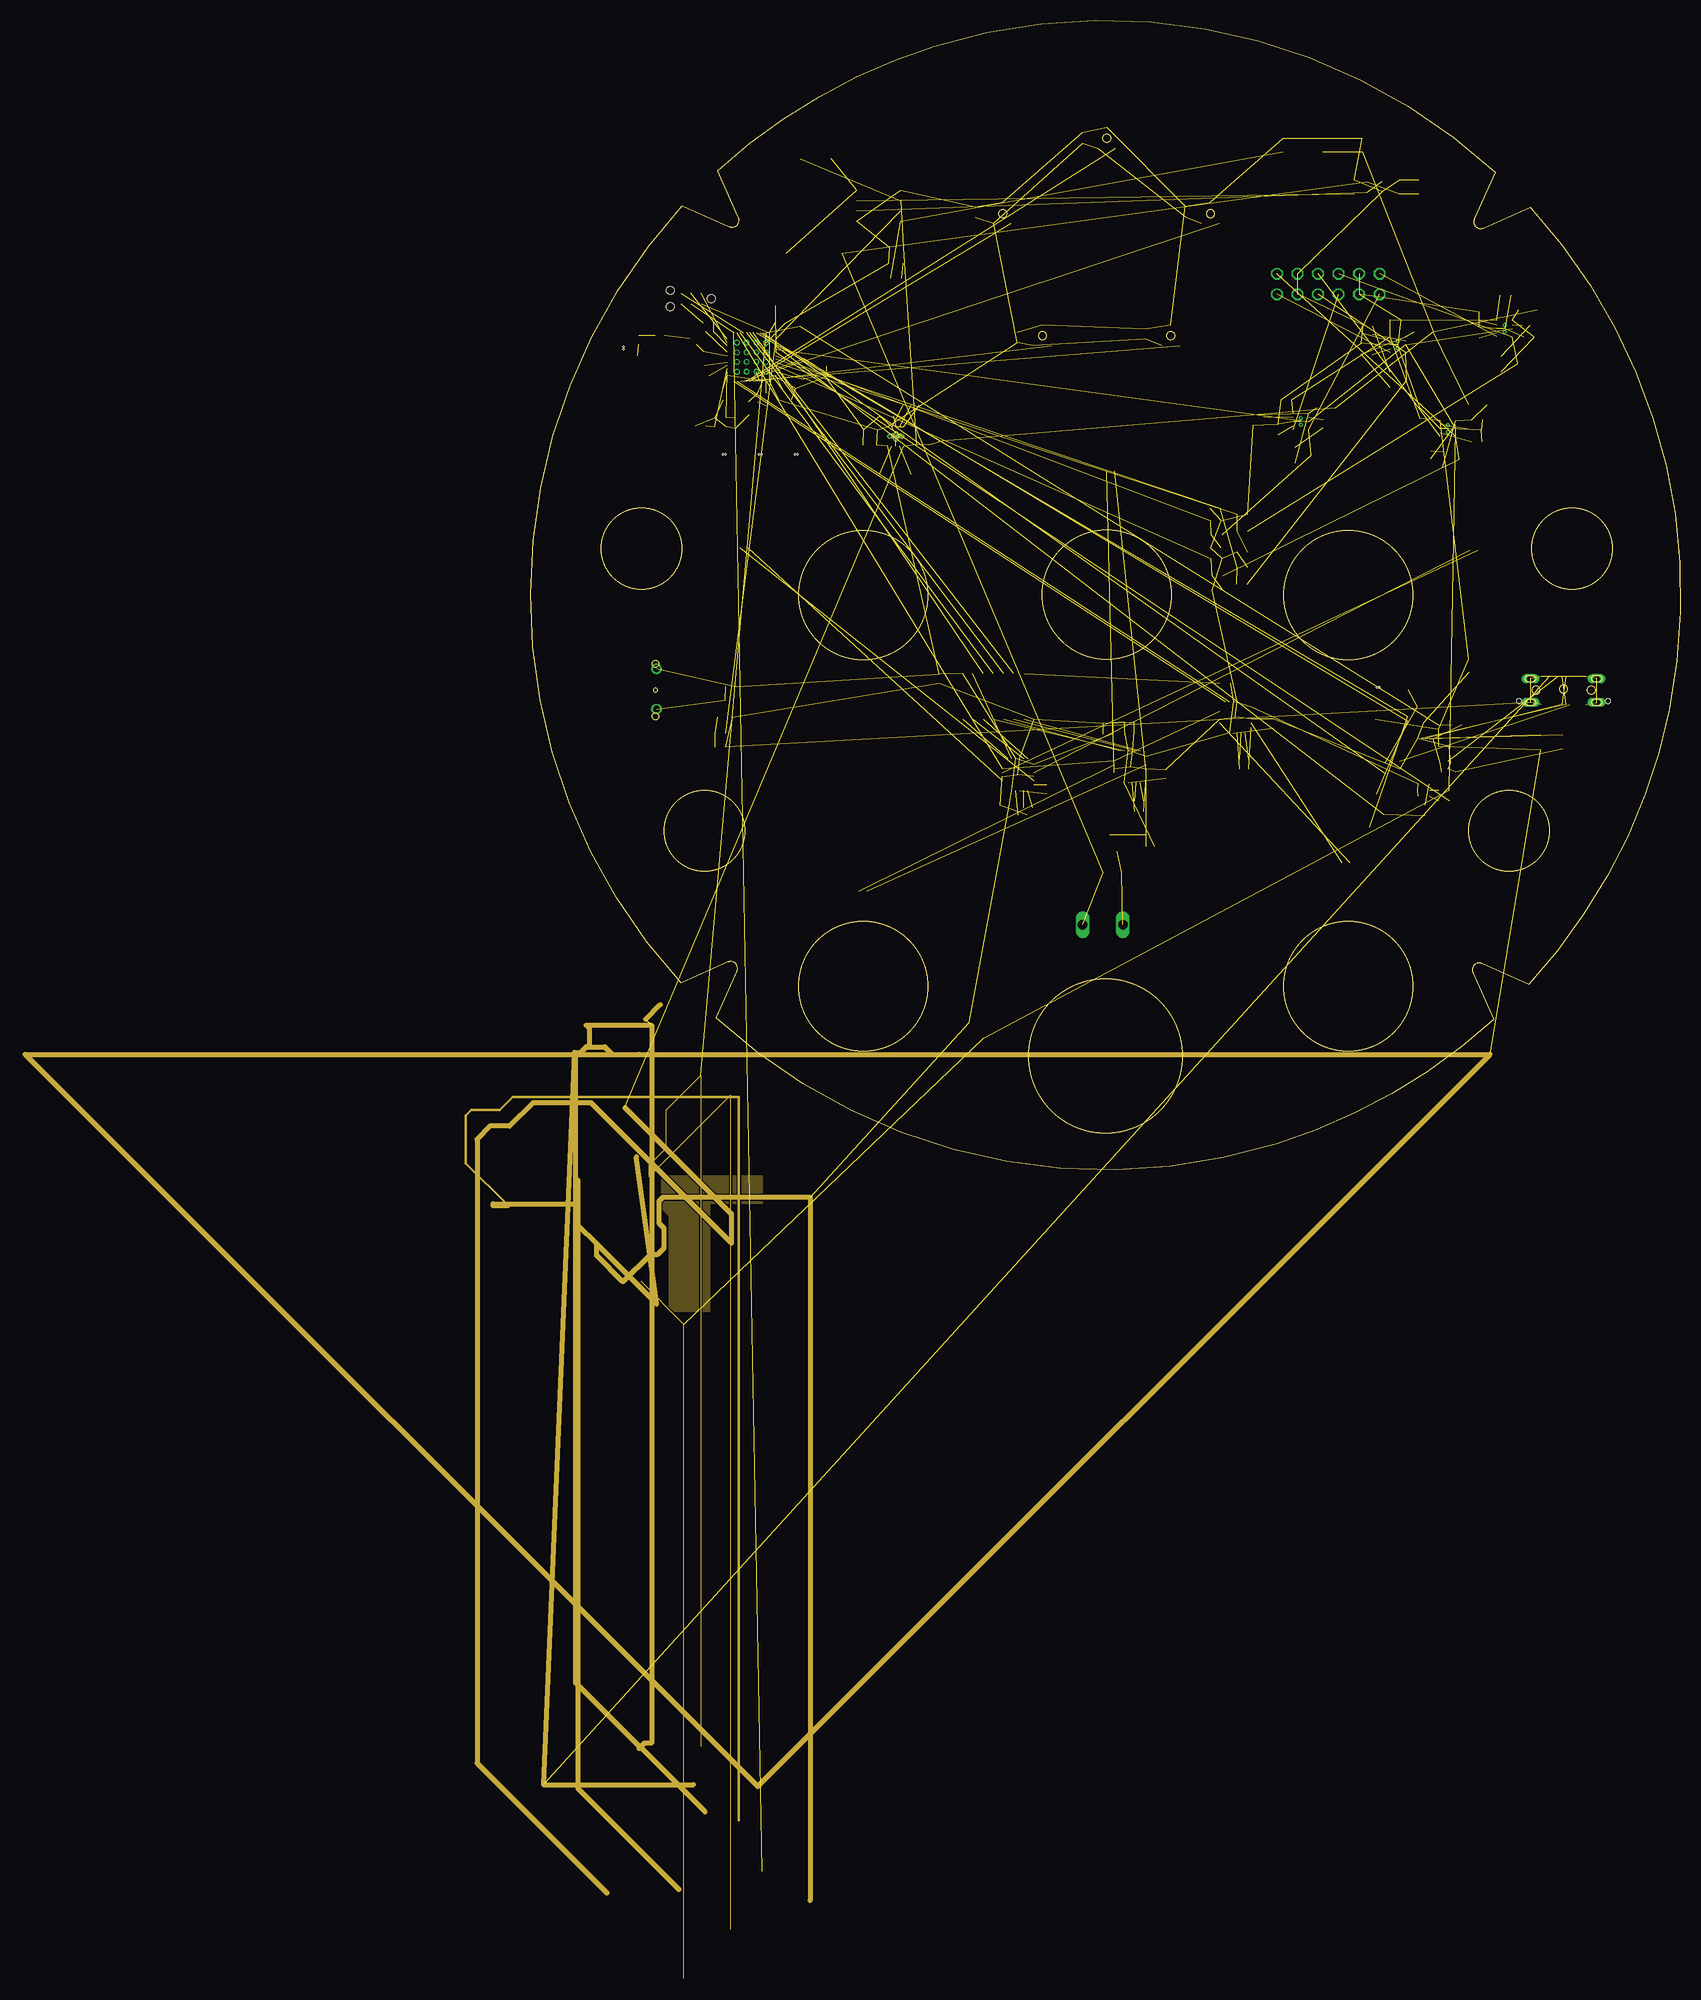
[diagram p5: board, inner layer Route15]
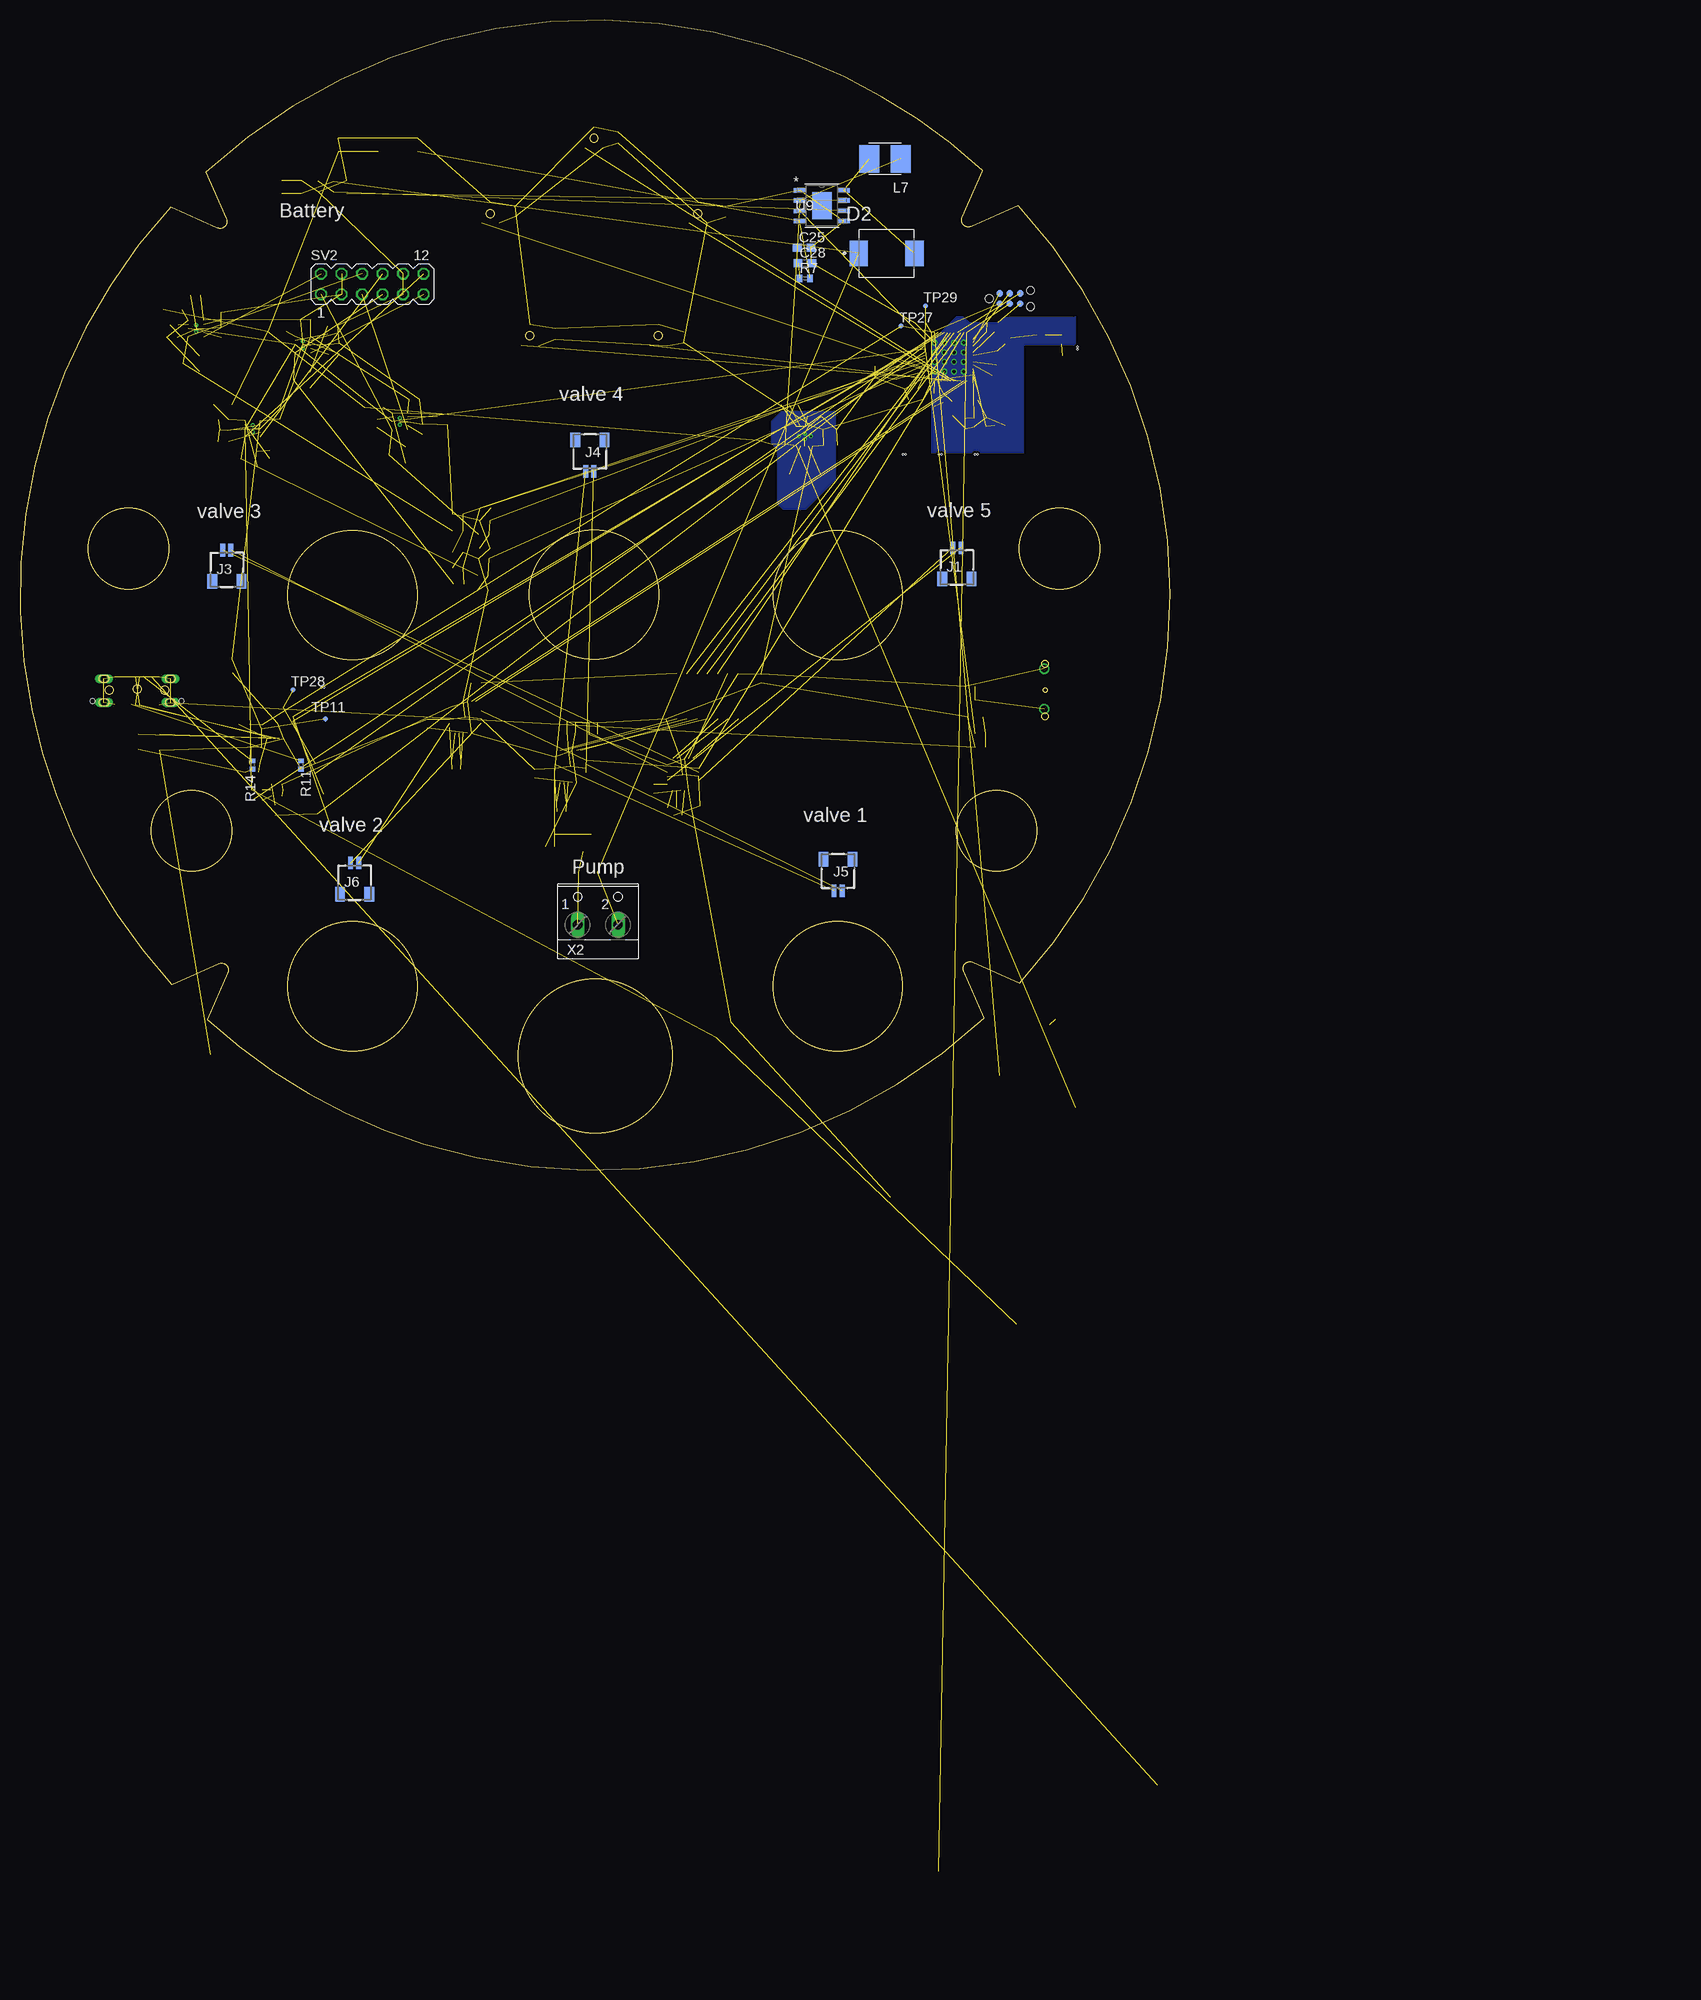
[diagram p6: board, bottom side, seen from below]

Size 142.25 x 142.25 mm. Coordinates in mm from the lower left corner, seen from the top.
Outline: 25.54,24.58 arc138 24.42,25.71
Outline: 18.62,23.14 arc-85 18.79,119.3
Outline: 24.6,116.72 arc138 25.73,117.85
Outline: 23.16,123.65 arc-25 49.95,139.03
Outline: 49.95,139.03 arc-60 119.31,123.46
Outline: 116.74,117.66 arc138 117.87,116.54
Outline: 123.66,119.1 arc-54 140.85,56.97
Outline: 140.85,56.97 arc-31 123.48,22.96
Outline: 117.68,25.53 arc138 116.56,24.4
Outline: 119.12,18.61 arc-25 92.32,3.22
Outline: 92.32,3.22 arc-60 22.97,18.77
Outline: 22.97,18.77 25.54,24.58
Outline: 25.54,24.58 arc138 24.42,25.71
Outline: 24.42,25.71 18.62,23.14
Outline: 18.62,23.14 arc-85 18.79,119.3
Outline: 18.79,119.3 24.6,116.72
Outline: 24.6,116.72 arc138 25.73,117.85
Outline: 25.73,117.85 23.16,123.65
Outline: 23.16,123.65 arc-25 49.95,139.03
Outline: 49.95,139.03 arc-60 119.31,123.46
Outline: 119.31,123.46 116.74,117.66
Outline: 116.74,117.66 arc138 117.87,116.54
Outline: 117.87,116.54 123.66,119.1
Outline: 123.66,119.1 arc-54 140.85,56.97
Outline: 140.85,56.97 arc-31 123.48,22.96
Outline: 123.48,22.96 117.68,25.53
Outline: 117.68,25.53 arc138 116.56,24.4
Outline: 116.56,24.4 119.12,18.61
Outline: 119.12,18.61 arc-25 92.32,3.22
Outline: 92.32,3.22 arc-60 22.97,18.77
Outline: circle at 79.2,103.23 radius 0.5
Outline: circle at 63.33,103.23 radius 0.5
Outline: circle at 58.43,118.32 radius 0.5
Outline: circle at 71.27,127.65 radius 0.5
Outline: circle at 84.11,118.32 radius 0.5
Outline: circle at 128.84,76.87 radius 5
Outline: circle at 121.05,41.96 radius 5
Outline: circle at 21.5,41.96 radius 5
Outline: circle at 13.71,76.87 radius 5
Outline: circle at 41.14,71.12 radius 8
Outline: circle at 71.28,71.17 radius 8
Outline: circle at 101.14,71.12 radius 8
Outline: circle at 101.14,22.72 radius 8
Outline: circle at 41.14,22.72 radius 8
Outline: circle at 71.12,14.1 radius 9.52
Outline: circle at 131.21,59.37 radius 0.5
Outline: circle at 124.37,59.37 radius 0.5
Outline: circle at 15.47,56.12 radius 0.4
Outline: circle at 15.47,62.62 radius 0.4
Outline: circle at 15.47,59.37 radius 0.25
Copper layers (1+2*15+16): Top 0.035mm / dielectric 0.213mm / Route2 0.035mm / dielectric 0.41mm / Route15 0.035mm / dielectric 0.213mm / Bottom 0.035mm
Design rules "default *": minimum track width 0.15mm, minimum drill 0.3mm, track to track 0.15mm, track to pad 0.15mm, pad to pad 0.15mm, via to via 0.15mm, smd to smd 0mil, copper to edge 0.3mm, drill to drill 0.3mm, minimum pad ring 0.15mm, minimum via ring 8mil, stop-mask expansion 0.025mm, vias tented up to drill 0.3mm, thermal gap 10mil
Holes 0.2 mm at 104.99,59.71 104.69,59.71 23.84,88.51 24.14,88.51 28.29,88.51 28.59,88.51 32.74,88.51 33.04,88.51 11.49,101.51 11.49,101.81

### Footprints (pad centres in the part's own frame; a part is rotated, then mirrored left to right if it is on the bottom)
C0402 = smd 0.7 x 0.9: 1 -0.65,0; 2 0.65,0
C0603 = smd 1.1 x 1: 1 -0.85,0; 2 0.85,0
RESC0402_N = smd 0.6 x 0.6: 1 -0.55,0; 2 0.55,0
LED_19-337C/RSBHGHC-A88/4T = smd 0.55 x 0.4: 1 0.675,0.725; 2 -0.675,0.725; 5 0.675,-0.725; 6 -0.675,-0.725 | smd 0.7 x 0.5: 3 0.75,0; 4 -0.75,0
DIOM7959X265N = smd 2.25 x 3.18: A 3.455,0; C -3.455,0
SOD-323 = smd 0.63 x 0.83: A 1.15,0; C -1.15,0
SOT23-W = smd 1.2 x 1.4: 1 -1.1,-1.3; 2 1.1,-1.3 | smd 1.8 x 1.2: 3 0,1.3
SM02B-SRSS-TB(LF)(SN) = smd 0.6 x 1.55: 1 -0.5,1.975; 2 0.5,1.975 | smd 1.2 x 1.8: 3 -1.8,-1.9; 4 1.8,-1.9
JAE_DX07S024WJ3R400 = smd 0.27 x 1.3: A1 -2.75,1.75; A2 -2.25,1.75; A3 -1.75,1.75; A4 -1.25,1.75; A5 -0.75,1.75; A6 -0.25,1.75; A7 0.25,1.75; A8 0.75,1.75; A9 1.25,1.75; A10 1.75,1.75; A11 2.25,1.75; A12 2.75,1.75; B1 2.75,-1.75; B2 2.25,-1.75; B3 1.75,-1.75; B4 1.25,-1.75; B5 0.75,-1.75; B6 0.25,-1.75; B7 -0.25,-1.75; B8 -0.75,-1.75; B9 -1.25,-1.75; B10 -1.75,-1.75; B11 -2.25,-1.75; B12 -2.75,-1.75 | drill 0.8 pad 1 long: S1 -4.1,1.47; S2 4.1,1.47; S3 4.1,-1.47; S4 -4.1,-1.47 | hole 0.6: -5.5,1.3; 5.5,1.3
SPARKFUN-JUMPERS_SMT-JUMPER_TRACE_SILK = smd 0.635 x 1.27: 1 -1.016,0; 2 0,0; 3 1.016,0
XFL4020 = smd 2.48 x 3.4: P$1 -1.93,0; P$2 1.93,0
RESC0603_N = smd 1.05 x 0.9: 1 -0.8,0; 2 0.8,0
XDCR_PS1240P02CT3 = drill 0.85 pad 1.28: 1 -2.5,0; 2 2.5,0
SOT23-3 = smd 0.8 x 0.9: 1 -0.95,-1; 2 0.95,-1; 3 0,1.1
R0402 = smd 0.7 x 0.9: 1 -0.65,0; 2 0.65,0
R0402' = smd 0.6 x 0.7: 1 -0.5,0; 2 0.5,0
MA06-2 = drill 1.016 octagon: 1 -6.35,-1.27; 2 -6.35,1.27; 3 -3.81,-1.27; 4 -3.81,1.27; 5 -1.27,-1.27; 6 -1.27,1.27; 7 1.27,-1.27; 8 1.27,1.27; 9 3.81,-1.27; 10 3.81,1.27; 11 6.35,-1.27; 12 6.35,1.27
SOT-23 = smd 0.787 x 0.889: 1 0.025,-1.016; 2 -0.94,1.016; 3 0.991,1.016
TP06R = smd 0.6 x 0.6: TP 0,0
SO16 = smd 0.6 x 1.2: 1 -4.445,-2.8; 2 -3.175,-2.8; 3 -1.905,-2.8; 4 -0.635,-2.8; 5 0.635,-2.8; 6 1.905,-2.8; 7 3.175,-2.8; 8 4.445,-2.8; 9 4.445,2.8; 10 3.175,2.8; 11 1.905,2.8; 12 0.635,2.8; 13 -0.635,2.8; 14 -1.905,2.8; 15 -3.175,2.8; 16 -4.445,2.8
QFN40P600X600X90-48_N = smd 0.65 x 0.2: 1 -3,2.2; 2 -3,1.8; 3 -3,1.4; 4 -3,1; 5 -3,0.6; 6 -3,0.2; 7 -3,-0.2; 8 -3,-0.6; 9 -3,-1; 10 -3,-1.4; 11 -3,-1.8; 12 -3,-2.2; 25 3,-2.2; 26 3,-1.8; 27 3,-1.4; 28 3,-1; 29 3,-0.6; 30 3,-0.2; 31 3,0.2; 32 3,0.6; 33 3,1; 34 3,1.4; 35 3,1.8; 36 3,2.2 | smd 0.2 x 0.65: 13 -2.2,-3; 14 -1.8,-3; 15 -1.4,-3; 16 -1,-3; 17 -0.6,-3; 18 -0.2,-3; 19 0.2,-3; 20 0.6,-3; 21 1,-3; 22 1.4,-3; 23 1.8,-3; 24 2.2,-3; 37 2.2,3; 38 1.8,3; 39 1.4,3; 40 1,3; 41 0.6,3; 42 0.2,3; 43 -0.2,3; 44 -0.6,3; 45 -1,3; 46 -1.4,3; 47 -1.8,3; 48 -2.2,3 | smd 4.7 x 4.7: PAD 0,0 | drill 0.4: PAD@VIA01 -1.8,1.8; PAD@VIA02 -1.8,0.6; PAD@VIA03 -1.8,-0.6; PAD@VIA04 -1.8,-1.8; PAD@VIA05 -0.6,1.8; PAD@VIA06 -0.6,0.6; PAD@VIA07 -0.6,-0.6; PAD@VIA08 -0.6,-1.8; PAD@VIA09 0.6,1.8; PAD@VIA10 0.6,0.6; PAD@VIA11 0.6,-0.6; PAD@VIA12 0.6,-1.8; PAD@VIA13 1.8,1.8; PAD@VIA14 1.8,0.6; PAD@VIA15 1.8,-0.6; PAD@VIA16 1.8,-1.8
QFN50P400X400X100-25N = smd 0.81 x 0.26: 1 -1.955,1.25; 2 -1.955,0.75; 3 -1.955,0.25; 4 -1.955,-0.25; 5 -1.955,-0.75; 6 -1.955,-1.25; 13 1.955,-1.25; 14 1.955,-0.75; 15 1.955,-0.25; 16 1.955,0.25; 17 1.955,0.75; 18 1.955,1.25 | smd 0.26 x 0.81: 7 -1.25,-1.955; 8 -0.75,-1.955; 9 -0.25,-1.955; 10 0.25,-1.955; 11 0.75,-1.955; 12 1.25,-1.955; 19 1.25,1.955; 20 0.75,1.955; 21 0.25,1.955; 22 -0.25,1.955; 23 -0.75,1.955; 24 -1.25,1.955 | smd 2.8 x 2.8: 25 0,0
QFN50P400X400X80-25N = smd 0.84 x 0.26: 1 -1.935,1.25; 2 -1.935,0.75; 3 -1.935,0.25; 4 -1.935,-0.25; 5 -1.935,-0.75; 6 -1.935,-1.25; 13 1.935,-1.25; 14 1.935,-0.75; 15 1.935,-0.25; 16 1.935,0.25; 17 1.935,0.75; 18 1.935,1.25 | smd 0.26 x 0.84: 7 -1.25,-1.935; 8 -0.75,-1.935; 9 -0.25,-1.935; 10 0.25,-1.935; 11 0.75,-1.935; 12 1.25,-1.935; 19 1.25,1.935; 20 0.75,1.935; 21 0.25,1.935; 22 -0.25,1.935; 23 -0.75,1.935; 24 -1.25,1.935 | smd 2.45 x 2.45: 25 0,0
SOT143 = smd 1.4 x 1.1: 1 -1.35,0.86 | smd 1.4 x 0.9: 2 -1.35,-0.96; 3 1.35,-0.96; 4 1.35,0.96
SON50P250X250X80-11N = smd 0.84 x 0.27: 1 -1.195,1; 2 -1.195,0.5; 3 -1.195,0; 4 -1.195,-0.5; 5 -1.195,-1; 6 1.195,-1; 7 1.195,-0.5; 8 1.195,0; 9 1.195,0.5; 10 1.195,1 | smd 1.2 x 2: 11 0,0 | drill 0.2 pad 0.3: 12 0.35,0; 13 -0.35,0; 14 0,0.75; 15 0,-0.75
SOP-8_PAM2423AECADJR_DIO = smd 1.462 x 0.559: 1 -2.725,1.905; 2 -2.725,0.635; 3 -2.725,-0.635; 4 -2.725,-1.905; 5 2.725,-1.905; 6 2.725,-0.635; 7 2.725,0.635; 8 2.725,1.905 | smd 2.413 x 3.302: EPAD 0,0
TEXAS_INSTRUMENTS_BQ25050DQCR_0 = smd 0.5 x 0.25: 1 -0.95,1; 2 -0.95,0.5; 3 -0.95,0; 4 -0.95,-0.5; 5 -0.95,-1; 6 0.95,-1; 7 0.95,-0.5; 8 0.95,0; 9 0.95,0.5; 10 0.95,1 | smd 0.84 x 2.4: 11 0,0 | drill 0.2 pad 0.5: PAD_1 0,0.416; PAD_2 0,-0.416
J-LINK_6-PIN_ADAPTER_S = smd 0.787 x 0.787: P$1 -1.27,-0.635; P$2 -1.27,0.635; P$3 0,-0.635; P$4 0,0.635; P$5 1.27,-0.635; P$6 1.27,0.635 | hole 0.991: -2.54,0; 2.54,1.016; 2.54,-1.016
2450AT18B100E = smd 1 x 1.6: P$1 -1.6,0; P$2 1.6,0
W237-102 = drill 1.194 long: 1 -2.5,-1.27; 2 2.5,-1.27
BT-XTAL_2016_N = smd 0.95 x 0.85: 1 -0.725,-0.575; 2 0.725,-0.575; 3 0.725,0.575; 4 -0.725,0.575
XTAL_3215_N = smd 1 x 1.8: 1 -1.25,0; 2 1.25,0

### Placement (x,y rotation side)
C1  60.19,103.01 90 top
C2  41.99,89.66 180 top
C3  54.99,118.51 90 top
C4  68.29,127.71 90 top
C5  113.19,50.36 180 top
C6  113.59,49.21 0 top
C7  42.09,91.61 180 top
C8  80.99,118.61 90 top
C9  44.04,93.26 0 top
C10  76.09,103.41 90 top
C11  50.59,60.81 90 top
C12  116.04,62.36 90 top
C13  25.3,92.35 270 top
C14  21.04,92.11 180 top
C15  21.86,101.79 45 top
C16  31.99,96.66 0 top
C17  30.89,104.76 0 top
C18  20.69,99.56 180 top
C19  21.39,98.26 180 top
C20  23.79,95.91 270 top
C21  31.49,95.31 0 top
C22  26.99,94.21 270 top
C23  35.89,98.11 180 top
C24  35.91,99.42 180 top
C25  45.29,114.11 0 bottom
C26  47.69,90.66 90 top
C27  113,52.4 0 top
C28  45.19,112.21 0 bottom
C29  93.09,126.81 90 top
C30  97.99,126.81 90 top
C31  61.59,44.81 180 top
C32  63.89,47.11 90 top
C33  60.89,43.91 180 top
C34  110.09,93.61 90 top
C35  15.99,103.26 0 top
C36  49.24,90.61 90 top
C37  50.94,91.06 90 top
C38  21.99,104.81 180 top
C39  117.09,92.81 180 top
C40  58.69,45.11 180 top
C41  117.09,90.11 180 top
C42  120.59,108.21 0 top
C43  123.49,103.01 0 top
C44  117.39,103.61 270 top
C45  106.99,105.21 0 top
C46  102.79,101.61 270 top
C47  104.09,101.51 270 top
C48  93.49,95.31 180 top
C49  89.39,92.81 90 top
C50  92.49,91.61 270 top
C51  102.89,126.81 90 top
C52  101.89,121.61 90 top
C53  109.89,121.61 90 top
C54  76.69,40.01 0 top
C55  88.29,50.81 180 top
C56  88.29,49.61 0 top
C57  91.89,55.21 270 top
C58  74.09,54.21 0 top
C59  74.09,55.41 180 top
C60  75.29,45.61 180 top
C61  75.29,44.31 0 top
C62  78.59,49.01 270 top
C63  71.39,53.91 180 top
C64  71.39,55.31 0 top
C65  107.49,121.61 90 top
C66  88.09,81.11 0 top
C67  88.09,74.51 0 top
C68  84.79,80.31 0 top
C69  84.89,75.61 0 top
D1  110.49,47.01 0 top
D2  35.09,113.41 0 bottom
D3  71.99,36.81 0 top
D4  123.39,106.41 180 top
D5  117.19,94.71 0 top
D6  110.49,103.71 180 top
D7  98.49,94.31 180 top
IC1  63.29,103.31 0 top
IC2  58.39,118.41 0 top
IC3  71.29,127.71 0 top
IC4  84.09,118.41 0 top
IC5  79.19,103.31 0 top
J1  26.39,75.01 0 bottom
J2  127.79,59.31 180 top
J3  116.69,74.71 0 bottom
J4  71.79,88.41 180 bottom
J5  41.09,36.51 180 bottom
J6  100.89,36.01 0 bottom
JP1  47.09,94.61 0 top
L1  45.14,86.11 0 top
L2  20.09,102.53 135 top
L3  29.19,95.31 270 top
L4  28.09,95.56 90 top
L5  14.49,103.81 270 top
L6  13.39,102.71 90 top
L7  35.29,125.11 180 bottom
LS1  15.59,59.51 90 top
Q1  24.09,57.01 0 top
Q2  72.59,40.51 180 top
R1  85.89,60.21 0 top
R2  110.69,44.51 270 top
R3  75.49,41.51 0 top
R4  112.99,47.01 0 top
R5  1k  [R0402']  117.09,91.51 180 top
R6  24.79,59.81 180 top
R7  45.19,110.31 0 bottom
R8  105.74,49.66 270 top
R9  103.49,121.61 90 top
R10  112.99,45.71 0 top
R11  5.1k  [R0402']  107.54,50.11 90 bottom
R12  105.39,121.71 90 top
R13  23.49,54.01 180 top
R14  5.1k  [R0402']  113.54,50.11 270 bottom
R15  23.49,52.31 0 top
R16  114.54,55.11 180 top
R17  1k  [R0402']  111.39,88.51 270 top
R18  1k  [R0402']  117.39,105.61 270 top
R19  1k  [R0402']  22.19,103.71 180 top
R20  1k  [R0402']  123.19,104.51 180 top
R21  1k  [R0402']  102.99,104.01 270 top
R22  1k  [R0402']  104.19,103.91 270 top
R23  1k  [R0402']  90.69,92.71 90 top
R24  1k  [R0402']  98.09,92.31 90 top
R25  88.09,79.01 0 top
R26  88.09,76.41 0 top
R27  87.99,72.51 0 top
R28  84.69,81.91 0 top
R29  84.89,78.61 0 top
R30  84.79,76.91 0 top
R31  84.99,73.51 0 top
R32  84.99,71.71 0 top
SV2  98.69,109.61 0 bottom
T1  113.89,87.91 90 top
T2  121.09,99.71 90 top
T3  107.39,97.71 90 top
T4  95.59,88.41 90 top
TP11  104.49,55.81 0 bottom
TP14  54.29,18.21 0 top
TP21  104.69,46.51 0 top
TP22  103.79,42.41 0 top
TP27  33.29,104.41 0 bottom
TP28  108.49,59.41 0 bottom
TP29  30.29,106.91 0 bottom
TP30  56.09,16.31 0 top
TP31  105.49,44.01 0 top
U1  57.89,58.61 0 top
U2  27.34,100.56 180 top
U3  60.29,48.91 0 top
U4  87.19,56.01 0 top
U5  110.44,55.31 90 top
U6  126.32,52.91 180 top
U7  74.19,49.91 0 top
U8  45.19,90.76 90 top
U9  43.09,119.31 0 bottom
U10  120.49,104.11 0 top
U11  113.49,91.71 0 top
U12  107.29,102.11 0 top
U13  95.29,92.61 0 top
U$1  19.82,107.81 0 bottom
U$16  13.29,99.16 270 top
X2  70.79,31.61 0 bottom
X3  23.49,92.51 0 top
X4  33.81,99.11 90 top

### Tracks (layer width: path | path; a pad name or v marks a point on that pad's centre or on a via)
3.3V  (45 unrouted)
  Route15 0.305: -2.78,-4.42 -8.01,0.81 -8.01,6.71 -7.31,7.41 -3.81,7.41 -2.21,9.01 25.74,9.01 25.74,-80.49
  Route15 0.61: -2.78,-4.42 -4.65,-4.4 -4.65,-4.2 5.87,-4.2 | 8.19,-9.19 8.19,-10.59 11.44,-13.84 14.85,-10.43 15.75,-10.43 16.49,-9.69 16.49,-7.19 15.89,-6.59 15.89,-3.89 16.39,-3.39 34.59,-3.39 34.59,-90.39 | 5.87,-4.2 5.87,-6.88 8.19,-9.19 | 5.87,-4.2 5.87,-2.58 | 18.39,-89.04 5.87,-76.53 5.87,-4.38 5.87,-2.58 | 13.09,1.61 15.6,-16.6 8.19,-9.19 | 5.87,-1.3 5.87,-2.58
12V  (5 unrouted)
ANT1  (2 unrouted)
BAT0  (3 unrouted)
BAT1  (3 unrouted)
BAT2  (3 unrouted)
BAT3  (3 unrouted)
BAT_ADC_0  (3 unrouted)
BAT_ADC_1  (3 unrouted)
BAT_ADC_2  (3 unrouted)
BAT_ADC_3  (3 unrouted)
BT_HALL  (1 unrouted)
BUZZER  (1 unrouted)
CLOCK  (1 unrouted)
DATA  (1 unrouted)
DEC1  (1 unrouted)
DEC2  (1 unrouted)
DEC3  (1 unrouted)
DEC4  (2 unrouted)
DN  (3 unrouted)
DP  (3 unrouted)
EN_OUT  (1 unrouted)
GND  (121 unrouted)
  Route15 0.61: U8.15 U8.14 | U8.13 U8.12
  cutout Route15: 4.44,21.41 4.44,19.11 3.09,19.11 3.09,21.41
  cutout Route15: 13.09,17.26 13.09,14.91 11.74,14.91 11.74,17.26
  cutout Route15: 13.04,21.41 13.04,19.11 11.79,19.11 11.79,21.41
  cutout Route15: 4.44,17.26 4.44,14.86 3.09,14.86 3.09,17.26
  pour Route2 (no thermals): -2.96,22.41 -8.81,16.56 -8.81,7.96 -9.16,7.61 -10.61,7.61 -11.21,7.01 -11.21,-1.24 -11.71,-1.74 -14.31,-1.74 -15.01,-2.44 -15.01,-8.89 -6.76,-17.14 22.19,-17.14 22.19,-4.39 22.29,-4.29 28.69,-4.29 28.69,-1.29 24.79,-1.29 24.79,7.91 22.69,7.91 22.69,16.71 16.99,22.41
  pour Bottom (no thermals): 41.39,85.46 41.39,93.81 48.14,93.81 49.34,92.61 49.34,90.01 48.59,89.26 48.59,82.51 47.84,81.76 45.09,81.76
  pour Top (no thermals): 46.09,90.16 46.89,90.96 49.54,90.96 50.04,91.46 51.09,91.46 51.14,91.51 51.14,92.56 50.09,92.56 49.59,92.06 47.06,92.06 46.31,91.31 43.94,91.31 43.84,91.21 43.84,90.41 44.04,90.21 46.04,90.21
  pour Top (isolate 0.2, no thermals): 25.19,88.71 25.19,91.41 24.99,91.61 19.99,91.61 19.69,91.91 19.69,94.51 20.59,94.51 20.59,99.81 25.19,99.81 25.19,104.66 24.19,105.66 11.69,105.66 11.69,102.06 18.19,102.06 18.19,88.71
  pour Bottom: 29.44,88.66 29.44,102.51 26.39,105.56 25.64,105.56 24.89,104.81 21.19,104.81 20.49,105.51 11.74,105.56 11.74,102.06 18.19,102.06 18.19,88.66
  pour Route15: 22.19,-17.59 17.19,-17.59 17.14,-12.54 17.14,-5.69 16.24,-4.79 16.24,-1.14 16.69,-0.69 28.69,-0.69 28.69,-4.24 22.19,-4.24
  cutout Top: 16.59,103.66 16.59,102.86 15.39,102.86 15.39,103.66
  cutout Top: 14.59,103.66 14.59,102.86 13.39,102.86 13.39,103.66
  cutout Top: 13.78,102.13 12.98,102.13 12.98,103.33 13.78,103.33
  cutout Top: 21.79,92.36 21.79,91.46 20.39,91.46 20.39,92.36
  cutout Top: 19.89,103.31 21.59,101.61 21.04,101.06 19.34,102.76
I_HALL  (1 unrouted)
II_HALL  (1 unrouted)
III_HALL  (1 unrouted)
IN1A  (1 unrouted)
IN1B  (1 unrouted)
IN2A  (1 unrouted)
IN2B  (1 unrouted)
IN3A  (1 unrouted)
IN3B  (1 unrouted)
IN4A  (1 unrouted)
IN4B  (1 unrouted)
IN5A  (1 unrouted)
IN5B  (1 unrouted)
ISENSE0  (1 unrouted)
ISENSE1  (1 unrouted)
ISENSE2  (1 unrouted)
ISENSE3  (1 unrouted)
LED_B  (2 unrouted)
LED_G  (2 unrouted)
LED_R  (7 unrouted)
  Route15 0.152: 13.69,-13.79 18.99,-19.09 18.99,-99.99
N$1  (2 unrouted)
N$2  (1 unrouted)
N$3  (2 unrouted)
N$4  (1 unrouted)
N$5  (1 unrouted)
N$6  (3 unrouted)
N$7  (1 unrouted)
  pour Top (no thermals): 48.14,84.46 45.99,84.46 45.54,84.91 45.54,88.91 45.59,88.96 45.84,88.96 47.04,87.76 47.89,87.76 48.14,87.51
N$8  (1 unrouted)
N$9  (1 unrouted)
N$10  (1 unrouted)
N$11  (1 unrouted)
  pour Top (no thermals): 44.99,88.71 44.99,84.81 44.64,84.46 43.54,84.46 43.24,84.76 43.24,87.46 44.49,88.71
N$12  (2 unrouted)
N$13  (1 unrouted)
N$14  (2 unrouted)
N$15  (1 unrouted)
N$16  (2 unrouted)
N$17  (1 unrouted)
N$18  (2 unrouted)
N$19  (1 unrouted)
N$20  (1 unrouted)
N$21  (1 unrouted)
N$23  (1 unrouted)
N$24  (1 unrouted)
N$26  (3 unrouted)
N$27  (1 unrouted)
N$28  (1 unrouted)
N$29  (2 unrouted)
N$30  (1 unrouted)
N$31  (3 unrouted)
N$33  (1 unrouted)
N$34  (1 unrouted)
N$36  (1 unrouted)
N$37  (3 unrouted)
N$39  (2 unrouted)
N$40  (1 unrouted)
N$41  (1 unrouted)
N$43  (1 unrouted)
N$44  (1 unrouted)
N$45  (1 unrouted)
N$46  (1 unrouted)
N$47  (1 unrouted)
N$48  (2 unrouted)
N$50  (1 unrouted)
N$51  (1 unrouted)
N$52  (1 unrouted)
N$53  (1 unrouted)
N$54  (1 unrouted)
N$55  (1 unrouted)
N$56  (3 unrouted)
N$58  (1 unrouted)
N$59  (1 unrouted)
N$60  (1 unrouted)
N$61  (1 unrouted)
N$62  (1 unrouted)
N$63  (1 unrouted)
N$64  (1 unrouted)
ON_HALL  (1 unrouted)
OUT1A  (1 unrouted)
OUT1B  (1 unrouted)
OUT2A  (1 unrouted)
OUT2B  (1 unrouted)
OUT3A  (1 unrouted)
OUT3B  (1 unrouted)
OUT4A  (1 unrouted)
OUT4B  (1 unrouted)
OUT5A  (1 unrouted)
OUT5B  (1 unrouted)
P0.00/XL1  (2 unrouted)
P0.01/XL2  (2 unrouted)
P0.22  (2 unrouted)
P0.24  (1 unrouted)
PSAVE  (3 unrouted)
PUMP  (1 unrouted)
PWR_EN_1  (1 unrouted)
RCK  (1 unrouted)
RST_CP  (4 unrouted)
  Route15 0.15: 24.76,-93.94 24.76,9.28 14.69,-0.79 14.69,0.63 16.79,2.73 16.79,7.39 21.09,11.69 21.09,-71.29
RST_NRF  (2 unrouted)
  Route2 0.305: 32.44,-90.59 28.64,-86.79 27.84,-86.79
RXD  (2 unrouted)
SUSPEND  (1 unrouted)
SWCLK  (1 unrouted)
SWDIO  (1 unrouted)
SWO  (1 unrouted)
TS0  (1 unrouted)
TS1  (1 unrouted)
TS2  (1 unrouted)
TS3  (1 unrouted)
TXD  (2 unrouted)
VBUS  (16 unrouted)
  Route15 0.61: 5.41,14.53 5.41,14.55 5.55,14.41 5.55,-63.41 21.59,-79.44 | 20.17,-76.07 1.6,-76.07 5.41,14.53 | 13.44,14.31 -62.51,14.31 28.09,-76.29 118.69,14.31 10.09,14.31 9.19,15.21 7.29,15.21 | 14.23,18.63 16.07,20.46 | 5.41,14.53 6.21,14.53 6.89,15.21 7.29,15.21 | 7.29,15.21 7.29,17.51 6.89,17.91 14.99,17.91 14.99,-70.94 14.09,-70.94 13.44,-71.59
VCC  (13 unrouted)
  Route15 0.61: 9.49,-89.49 -6.61,-73.39 -6.61,3.81 -5.01,5.41 -2.57,5.41 0.33,8.31 7.49,8.31 24.84,-9.04 24.84,-5.44 11.69,7.71
VDD  (4 unrouted)
X2  (2 unrouted)

### Text on the board
bNames: Battery | valve 4 | valve 5 | valve 3 | valve 1 | valve 2 | Pump